# EAGLE design PSPS_AVNC_SRD_fullBoard-2020-09-19 (EAGLE 9.6.2)
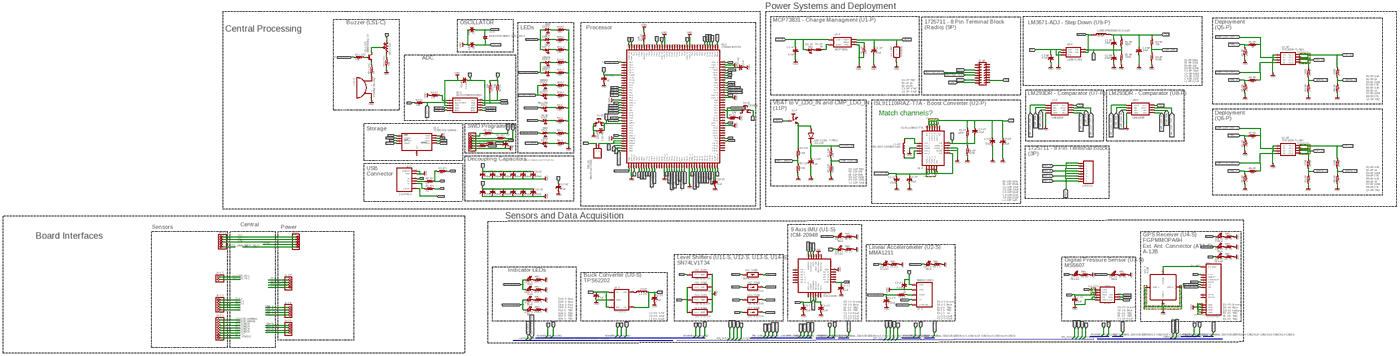
[diagram p0: schematic, sheet 1, overview]
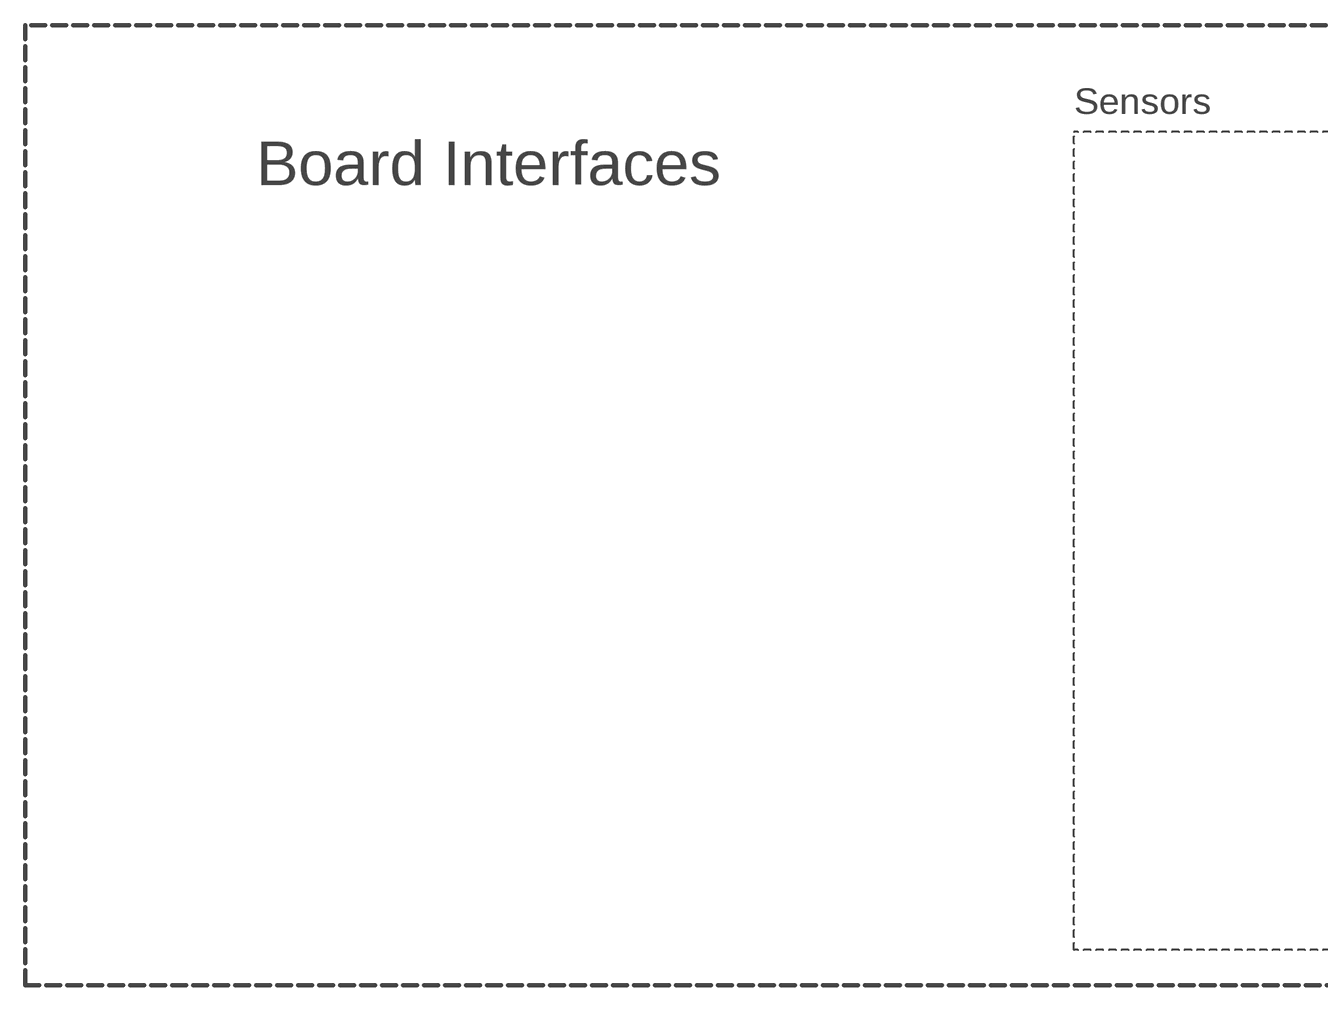
[diagram p1: schematic, sheet 1, part 1 of 4]
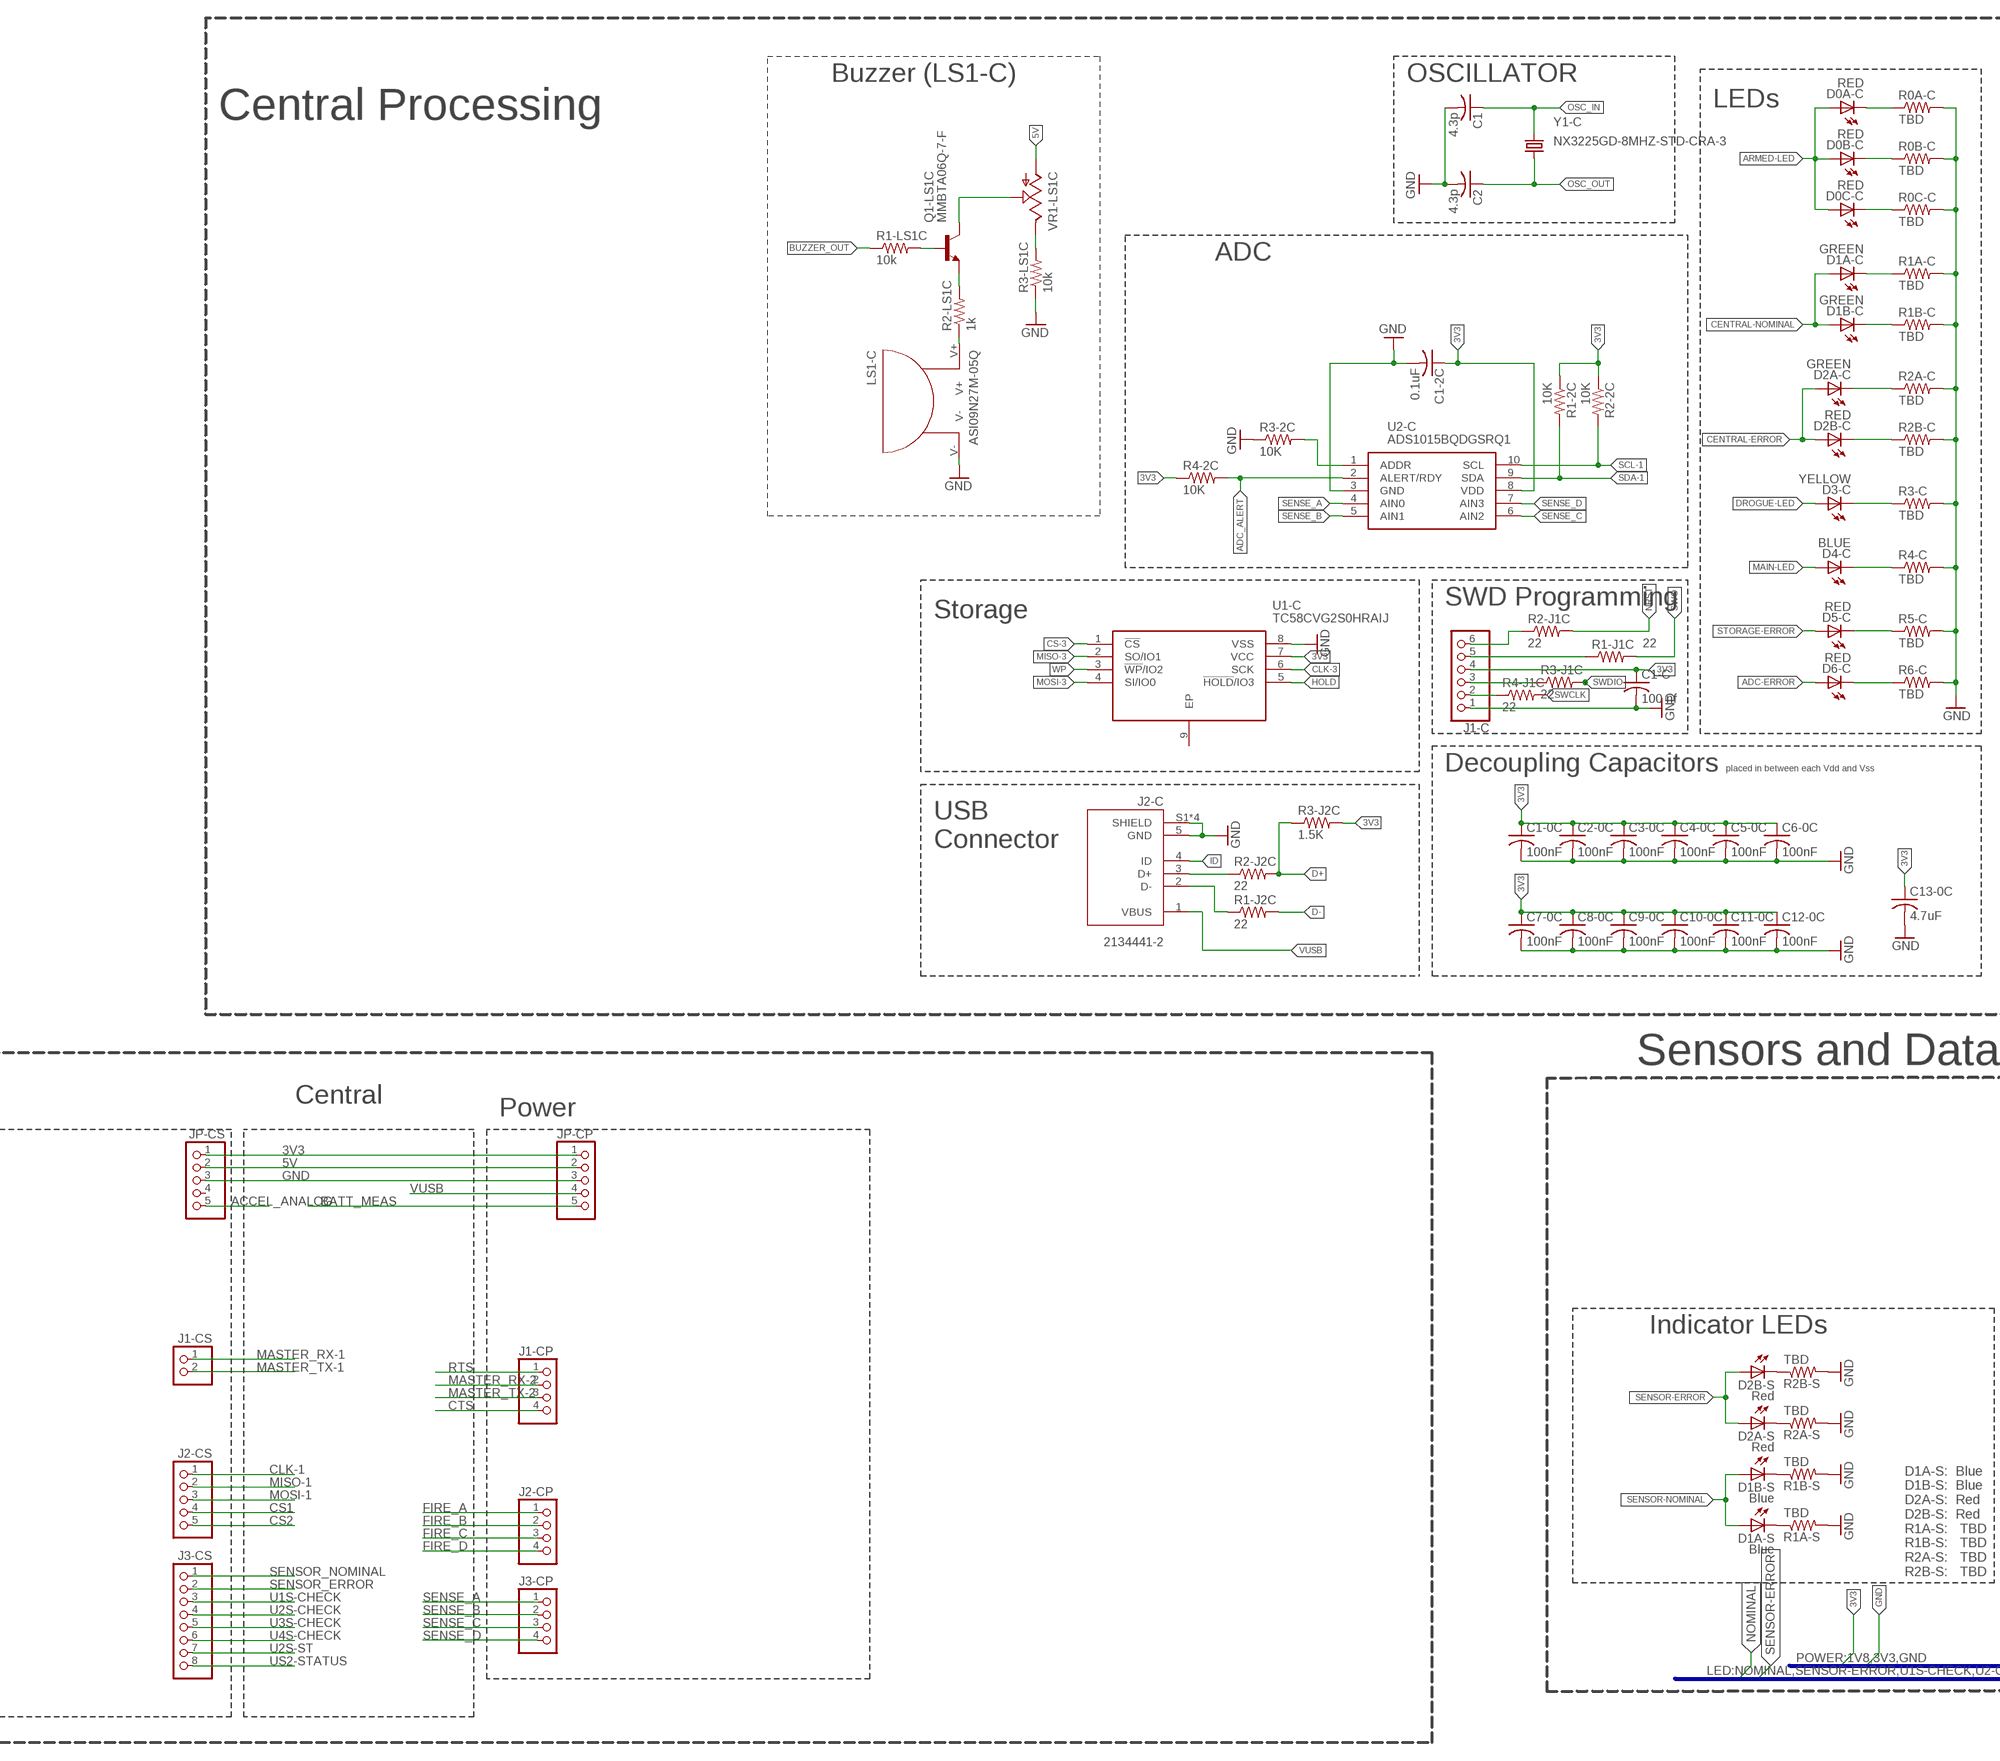
[diagram p2: schematic, sheet 1, part 2 of 4]
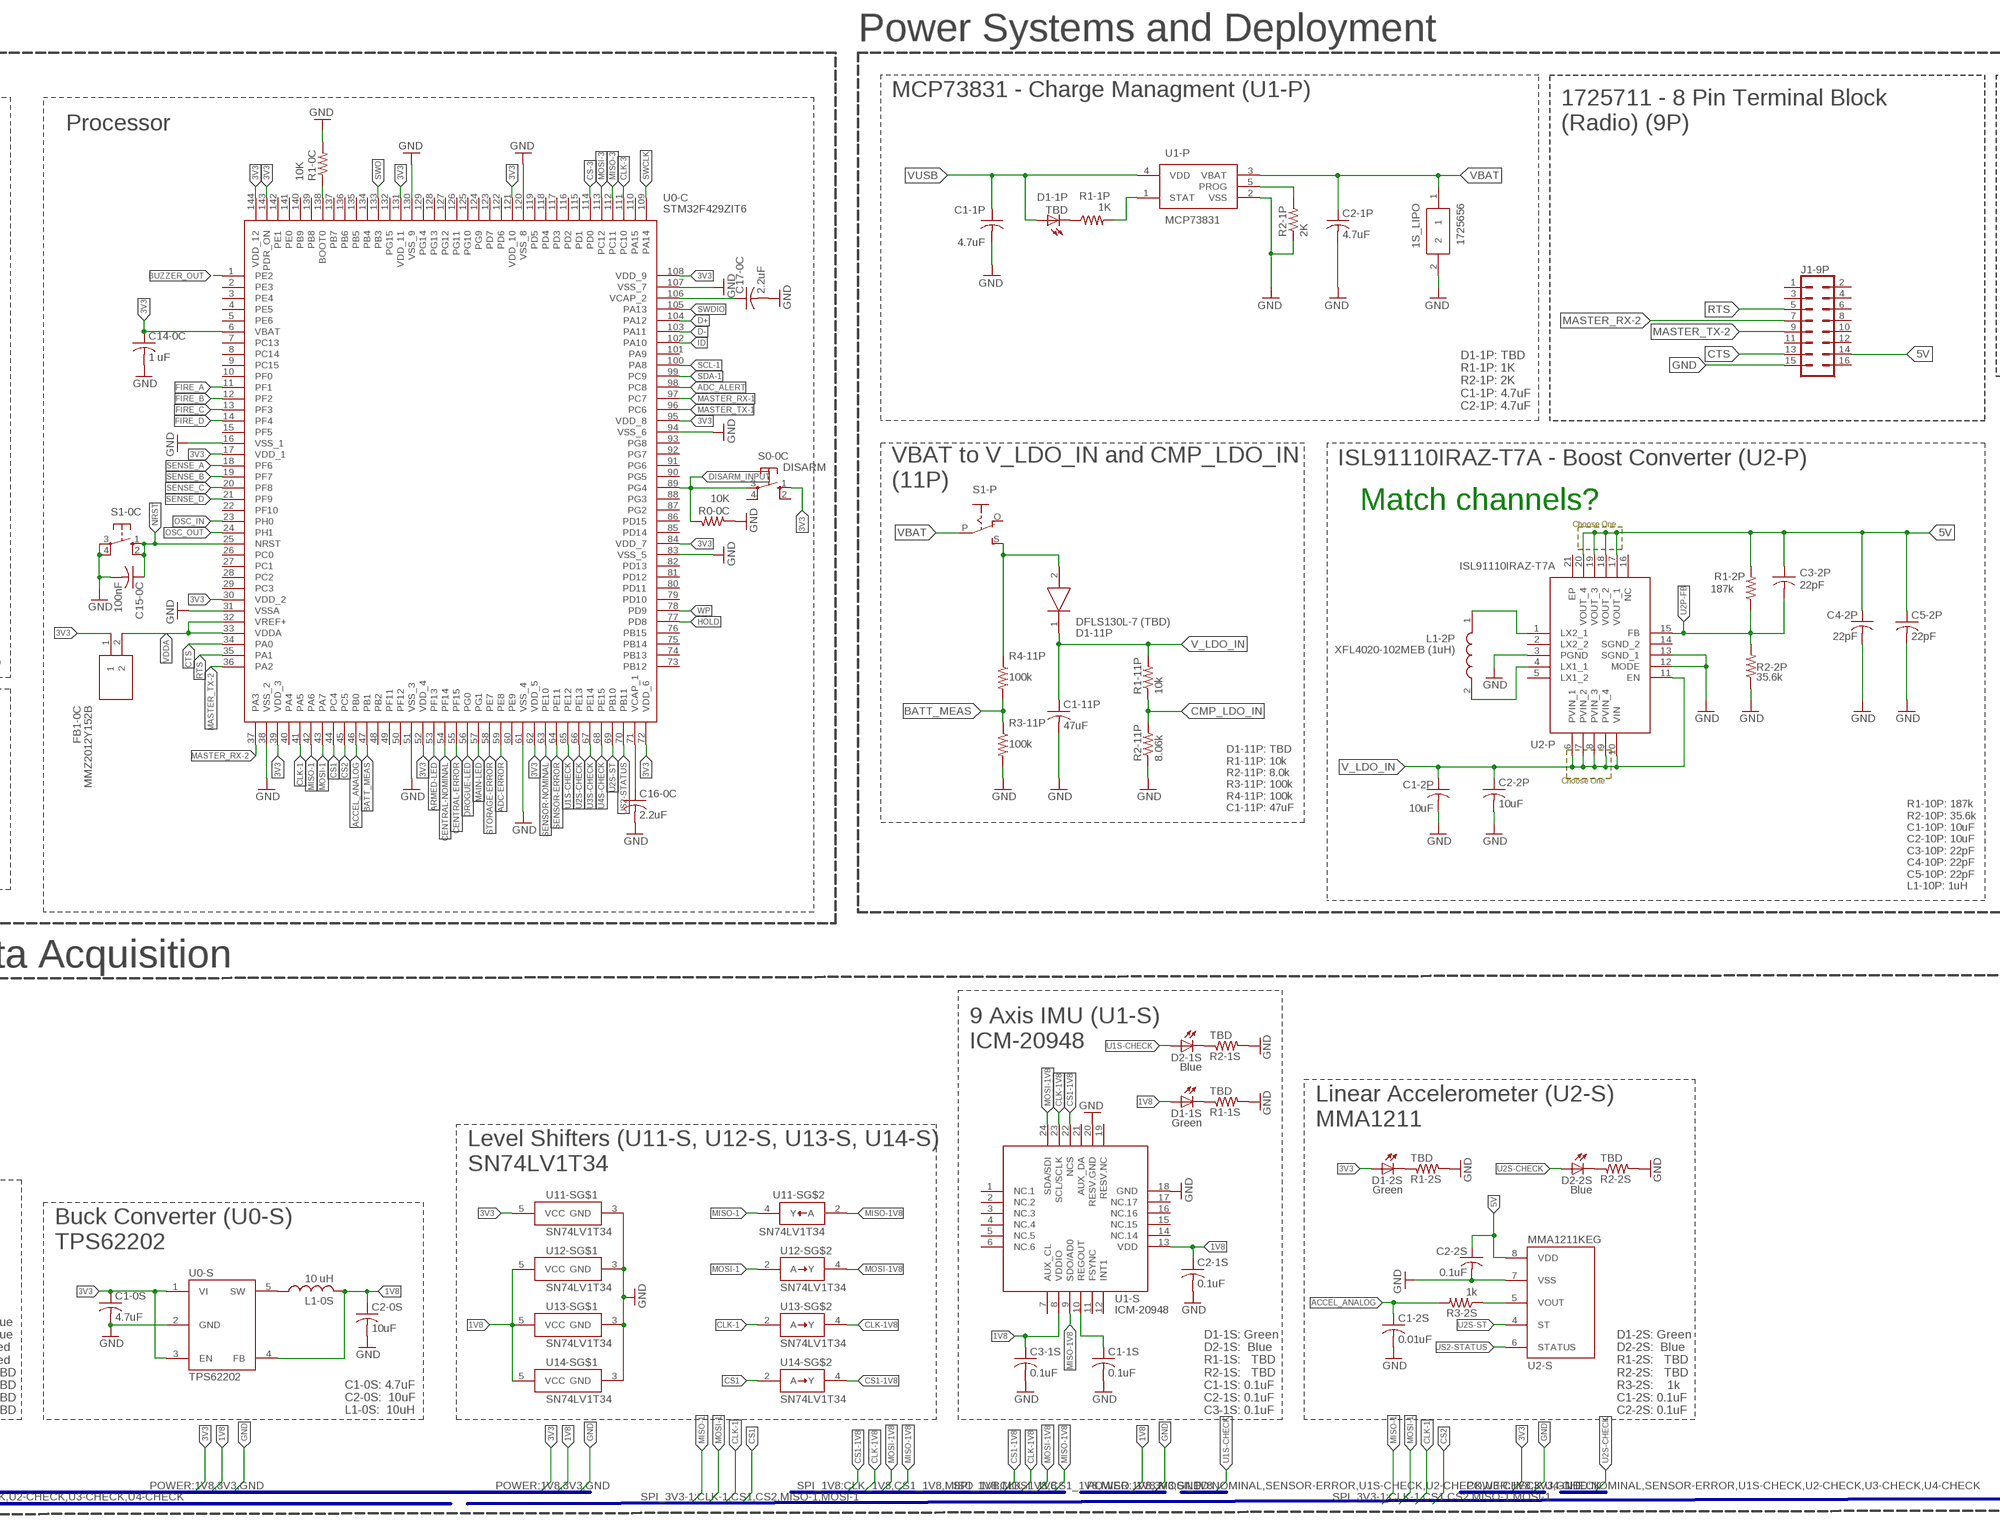
[diagram p3: schematic, sheet 1, part 3 of 4]
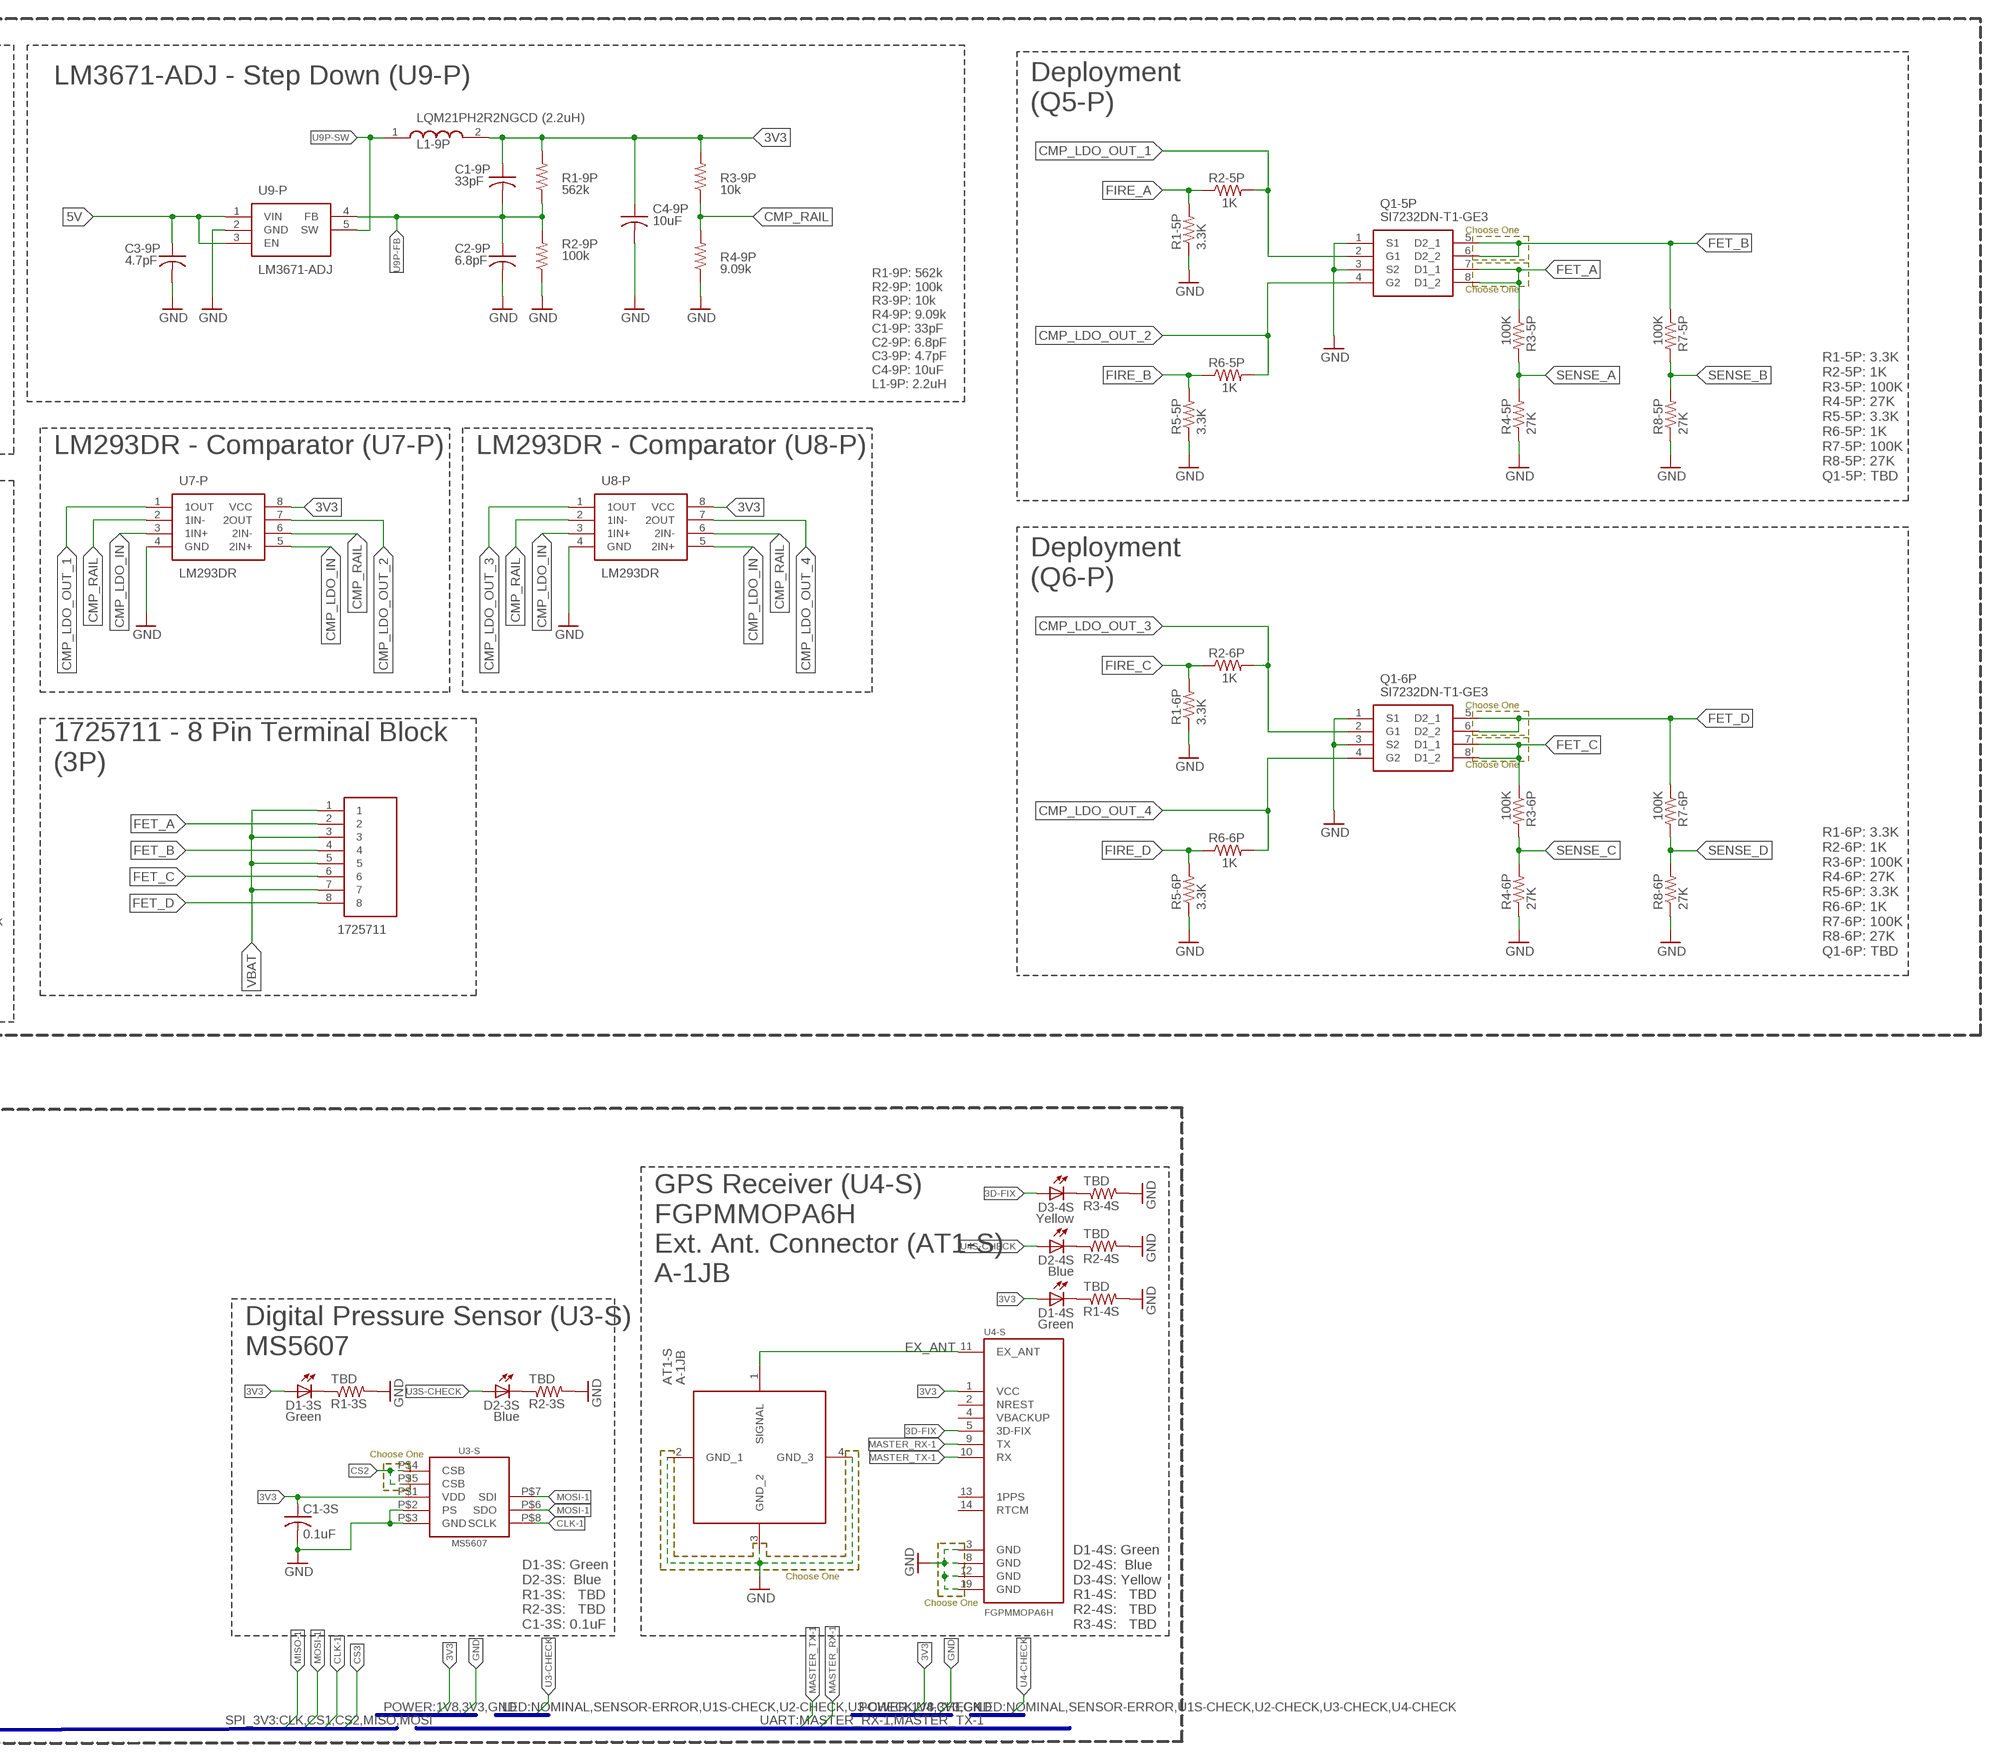
[diagram p4: schematic, sheet 1, part 4 of 4]

## Parts
1S_LIPO  1725656  [1725656]
AT1-S  A-1JB  [A1JB]
C1  4.3p  C-USC0805  [C0805]
C1-0C  100nF  C-USC0805  [C0805]
C1-0S  4.7uF  C-USC0805  [C0805]
C1-1P  4.7uF  C-USC0805  [C0805]
C1-1S  0.1uF  C-USC0805  [C0805]
C1-2C  0.1uF  C-USC0805  [C0805]
C1-2P  10uF  C-USC0805  [C0805]
C1-2S  0.01uF  C-USC0805  [C0805]
C1-3S  0.1uF  C-USC0805  [C0805]
C1-9P  33pF  C-USC0805  [C0805]
C1-11P  47uF  C-USC0805  [C0805]
C1-C  100 nf  C-USC0805  [C0805]
C2  4.3p  C-USC0805  [C0805]
C2-0C  100nF  C-USC0805  [C0805]
C2-0S  10uF  C-USC0805  [C0805]
C2-1P  4.7uF  C-USC0805  [C0805]
C2-1S  0.1uF  C-USC0805  [C0805]
C2-2P  10uF  C-USC0805  [C0805]
C2-2S  0.1uF  C-USC0805  [C0805]
C2-9P  6.8pF  C-USC0805  [C0805]
C3-0C  100nF  C-USC0805  [C0805]
C3-1S  0.1uF  C-USC0805  [C0805]
C3-2P  22pF  C-USC0805  [C0805]
C3-9P  4.7pF  C-USC0805  [C0805]
C4-0C  100nF  C-USC0805  [C0805]
C4-2P  22pF  C-USC0805  [C0805]
C4-9P  10uF  C-USC0805  [C0805]
C5-0C  100nF  C-USC0805  [C0805]
C5-2P  22pF  C-USC0805  [C0805]
C6-0C  100nF  C-USC0805  [C0805]
C7-0C  100nF  C-USC0805  [C0805]
C8-0C  100nF  C-USC0805  [C0805]
C9-0C  100nF  C-USC0805  [C0805]
C10-0C  100nF  C-USC0805  [C0805]
C11-0C  100nF  C-USC0805  [C0805]
C12-0C  100nF  C-USC0805  [C0805]
C13-0C  4.7uF  C-USC0805  [C0805]
C14-0C  1 uF  C-USC0805  [C0805]
C15-0C  100nF  C-USC0805  [C0805]
C16-0C  2.2uF  C-USC0805  [C0805]
C17-0C  2.2uF  C-USC0805  [C0805]
D0A-C  RED  LEDCHIPLED_0805  [CHIPLED_0805]
D0B-C  RED  LEDCHIPLED_0805  [CHIPLED_0805]
D0C-C  RED  LEDCHIPLED_0805  [CHIPLED_0805]
D1-1P  TBD  LEDCHIPLED_0805  [CHIPLED_0805]
D1-1S  Green  LEDCHIPLED_0805  [CHIPLED_0805]
D1-2S  Green  LEDCHIPLED_0805  [CHIPLED_0805]
D1-3S  Green  LEDCHIPLED_0805  [CHIPLED_0805]
D1-4S  Green  LEDCHIPLED_0805  [CHIPLED_0805]
D1-11P  DFLS130L-7 (TBD)  DFLS130L-7  [POWERDI_123]
D1A-C  GREEN  LEDCHIPLED_0805  [CHIPLED_0805]
D1A-S  Blue  LEDCHIPLED_0805  [CHIPLED_0805]
D1B-C  GREEN  LEDCHIPLED_0805  [CHIPLED_0805]
D1B-S  Blue  LEDCHIPLED_0805  [CHIPLED_0805]
D2-1S  Blue  LEDCHIPLED_0805  [CHIPLED_0805]
D2-2S  Blue  LEDCHIPLED_0805  [CHIPLED_0805]
D2-3S  Blue  LEDCHIPLED_0805  [CHIPLED_0805]
D2-4S  Blue  LEDCHIPLED_0805  [CHIPLED_0805]
D2A-C  GREEN  LEDCHIPLED_0805  [CHIPLED_0805]
D2A-S  Red  LEDCHIPLED_0805  [CHIPLED_0805]
D2B-C  RED  LEDCHIPLED_0805  [CHIPLED_0805]
D2B-S  Red  LEDCHIPLED_0805  [CHIPLED_0805]
D3-4S  Yellow  LEDCHIPLED_0805  [CHIPLED_0805]
D3-C  YELLOW  LEDCHIPLED_0805  [CHIPLED_0805]
D4-C  BLUE  LEDCHIPLED_0805  [CHIPLED_0805]
D5-C  RED  LEDCHIPLED_0805  [CHIPLED_0805]
D6-C  RED  LEDCHIPLED_0805  [CHIPLED_0805]
FB1-0C  MMZ2012Y152B  [BEADC2012X105N]
J1-9P  CONN_08X2  [2X8]
J1-C  PINHD-1X6  [1X06]
J1-CP  PINHD-1X4  [1X04]
J1-CS  PINHD-1X2  [1X02]
J2-C  2134441-2  [TE_2134441-2]
J2-CP  PINHD-1X4  [1X04]
J2-CS  PINHD-1X5  [1X05]
J2-P  1725711  [1725711]
J3-CP  PINHD-1X4  [1X04]
J3-CS  PINHD-1X8  [1X08]
JP-CP  PINHD-1X5  [1X05]
JP-CS  PINHD-1X5  [1X05]
L1-0S  10 uH  PF0560.103NLT  [PF0560NL]
L1-2P  XFL4020-102MEB (1uH)  XFL4020-102MEB  [XFL4020]
L1-9P  LQM21PH2R2NGCD (2.2uH)  LQM21PH2R2NGCD  [INDC2012X100N]
LS1-C  ASI09N27M-05Q  [ASI09N27M-05Q]
Q1-5P  SI7232DN-T1-GE3  [POWERPAK-1212-8]
Q1-6P  SI7232DN-T1-GE3  [POWERPAK-1212-8]
Q1-LS1C  MMBTA06Q-7-F  NPN_TRANSISTOR  [SOT23]
R0-0C  10K  R-US_R0805  [R0805]
R0A-C  TBD  R-US_M0805  [M0805]
R0B-C  TBD  R-US_M0805  [M0805]
R0C-C  TBD  R-US_M0805  [M0805]
R1-0C  10K  R-US_R0805  [R0805]
R1-1P  1K  R-US_R0805  [R0805]
R1-1S  TBD  R-US_R0805  [R0805]
R1-2C  10K  R-US_R0805  [R0805]
R1-2P  187k  R-US_R0805  [R0805]
R1-2S  TBD  R-US_R0805  [R0805]
R1-3S  TBD  R-US_R0805  [R0805]
R1-4S  TBD  R-US_R0805  [R0805]
R1-5P  3.3K  R-US_M0805  [M0805]
R1-6P  3.3K  R-US_M0805  [M0805]
R1-9P  562k  R-US_R0805  [R0805]
R1-11P  10k  R-US_R0805  [R0805]
R1-J1C  22  R-US_M0805  [M0805]
R1-J2C  22  R-US_M0805  [M0805]
R1-LS1C  10k  R-US_R0805  [R0805]
R1A-C  TBD  R-US_M0805  [M0805]
R1A-S  TBD  R-US_R0805  [R0805]
R1B-C  TBD  R-US_M0805  [M0805]
R1B-S  TBD  R-US_R0805  [R0805]
R2-1P  2K  R-US_R0805  [R0805]
R2-1S  TBD  R-US_R0805  [R0805]
R2-2C  10K  R-US_R0805  [R0805]
R2-2P  35.6k  R-US_R0805  [R0805]
R2-2S  TBD  R-US_R0805  [R0805]
R2-3S  TBD  R-US_R0805  [R0805]
R2-4S  TBD  R-US_R0805  [R0805]
R2-5P  1K  R-US_M0805  [M0805]
R2-6P  1K  R-US_M0805  [M0805]
R2-9P  100k  R-US_R0805  [R0805]
R2-11P  8.06k  R-US_R0805  [R0805]
R2-J1C  22  R-US_M0805  [M0805]
R2-J2C  22  R-US_M0805  [M0805]
R2-LS1C  1k  R-US_R0805  [R0805]
R2A-C  TBD  R-US_M0805  [M0805]
R2A-S  TBD  R-US_R0805  [R0805]
R2B-C  TBD  R-US_M0805  [M0805]
R2B-S  TBD  R-US_R0805  [R0805]
R3-2C  10K  R-US_R0805  [R0805]
R3-2S  1k  R-US_R0805  [R0805]
R3-4S  TBD  R-US_R0805  [R0805]
R3-5P  100K  R-US_M0805  [M0805]
R3-6P  100K  R-US_M0805  [M0805]
R3-9P  10k  R-US_R0805  [R0805]
R3-11P  100k  R-US_R0805  [R0805]
R3-C  TBD  R-US_M0805  [M0805]
R3-J1C  22  R-US_M0805  [M0805]
R3-J2C  1.5K  R-US_M0805  [M0805]
R3-LS1C  10k  R-US_R0805  [R0805]
R4-2C  10K  R-US_R0805  [R0805]
R4-5P  27K  R-US_M0805  [M0805]
R4-6P  27K  R-US_M0805  [M0805]
R4-9P  9.09k  R-US_R0805  [R0805]
R4-11P  100k  R-US_R0805  [R0805]
R4-C  TBD  R-US_M0805  [M0805]
R4-J1C  22  R-US_M0805  [M0805]
R5-5P  3.3K  R-US_M0805  [M0805]
R5-6P  3.3K  R-US_M0805  [M0805]
R5-C  TBD  R-US_M0805  [M0805]
R6-5P  1K  R-US_M0805  [M0805]
R6-6P  1K  R-US_M0805  [M0805]
R6-C  TBD  R-US_M0805  [M0805]
R7-5P  100K  R-US_M0805  [M0805]
R7-6P  100K  R-US_M0805  [M0805]
R8-5P  27K  R-US_M0805  [M0805]
R8-6P  27K  R-US_M0805  [M0805]
S0-0C  DISARM  10-XX  [B3F-10XX]
S1-0C  10-XX  [B3F-10XX]
S1-P  EG1218S  [EG1218]
U0-C  STM32F429ZIT6  [QFP50P2200X2200X160-144N]
U0-S  TPS62202  [SOT95P280X145-5]
U1-C  TC58CVG2S0HRAIJ  [SON127P800X600X80-9N]
U1-P  MCP73831  MCP73831T-2ACI_OT  [SOT95P270X145-5N]
U1-S  ICM-20948  [QFN40P300X300X105-25T159X175]
U2-C  ADS1015BQDGSRQ1  [SOP50P490X110-10N]
U2-P  ISL91110IRAZ-T7A  [QFN50P400X400X100-21N]
U2-S  MMA1211KEG  [SOIC127P1041X355-16N]
U3-S  MS5607  [MS5607]
U4-S  FGPMMOPA6H  [SOIC127P1800X470-20N]
U7-P  LM293DR  [SOIC127P600X175-8N]
U8-P  LM293DR  [SOIC127P600X175-8N]
U9-P  LM3671-ADJ  LM3671MFX-ADJ_NOPB  [SOT95P280X145-5N]
U11-S  SN74LV1T34  [SOT65P210X110-5]
U12-S  SN74LV1T34  [SOT65P210X110-5]
U13-S  SN74LV1T34  [SOT65P210X110-5]
U14-S  SN74LV1T34  [SOT65P210X110-5]
VR1-LS1C  TRIM_US-LI10  [LI10]
Y1-C  NX3225GD-8MHZ-STD-CRA-3  KX-7  [3.2X2.5_KX-7]

## Nets
1V8: C2-0S.1 C2-1S.1 C3-1S.1 D1-1S.A L1-0S.P$2 U0-S.4(FB) U1-S.8(VDDIO) U1-S.13(VDD) U12-S.5(VCC) U13-S.5(VCC) U14-S.5(VCC)
3D-FIX: D3-4S.A U4-S.5(3D-FIX)
3V3: C1-0C.1 C1-0S.1 C1-2C.1 C1-3S.1 C1-9P.1 C1-C.1 C2-0C.1 C3-0C.1 C4-0C.1 C4-9P.1 C5-0C.1 C6-0C.1 C7-0C.1 C8-0C.1 C9-0C.1 C10-0C.1 C11-0C.1 C12-0C.1 C13-0C.1 C14-0C.1 D1-2S.A D1-3S.A D1-4S.A FB1-0C.1 J1-C.4 JP-CP.1 JP-CS.1 L1-9P.2 R1-2C.1 R1-9P.2 R2-2C.1 R3-9P.2 R3-J2C.2 R4-2C.1 S0-0C.1(S) U0-C.6(VBAT) U0-C.17(VDD_1) U0-C.30(VDD_2) U0-C.39(VDD_3) U0-C.52(VDD_4) U0-C.62(VDD_5) U0-C.72(VDD_6) U0-C.84(VDD_7) U0-C.95(VDD_8) U0-C.108(VDD_9) U0-C.121(VDD_10) U0-C.131(VDD_11) U0-C.143(PDR_ON) U0-C.144(VDD_12) U0-S.1(VI) U0-S.3(EN) U1-C.7(VCC) U2-C.8(VDD) U3-S.P$1(VDD) U4-S.1(VCC) U7-P.8(VCC) U8-P.8(VCC) U11-S.5(VCC)
5V: C2-2S.1 C3-2P.1 C3-9P.1 C4-2P.1 C5-2P.1 J1-9P.14 JP-CP.2 JP-CS.2 R1-2P.2 U2-P.17(VOUT_1) U2-P.18(VOUT_2) U2-P.19(VOUT_3) U2-P.20(VOUT_4) U2-S.8(VDD) U9-P.1(VIN) U9-P.3(EN) VR1-LS1C.A
ACCEL_ANALOG: C1-2S.1 JP-CS.5 R3-2S.2 U0-C.46(PB0)
ADC-ERROR: D6-C.A U0-C.59(PE8)
ADC_ALERT: R4-2C.2 U0-C.98(PC8) U2-C.2(ALERT/RDY)
ADDR: R3-2C.2 U2-C.1(ADDR)
ARMED-LED: D0A-C.A D0B-C.A D0C-C.A U0-C.53(PF13)
BATT_MEAS: JP-CP.5 R3-11P.1 R4-11P.2 U0-C.47(PB1)
BOOT0: R1-0C.1 U0-C.138(BOOT0)
BUZZER_OUT: R1-LS1C.1 U0-C.1(PE2)
CENTRAL-ERROR: D2A-C.A D2B-C.A U0-C.55(PF15)
CENTRAL-NOMINAL: D1A-C.A D1B-C.A U0-C.54(PF14)
CLK-1: J2-CS.1 U0-C.41(PA5) U3-S.P$8(SCLK) U13-S.2(A)
CLK-1V8: U1-S.23(SCL/SCLK) U13-S.4(Y)
CLK-3: U0-C.111(PC10) U1-C.6(SCK)
CMP_LDO_IN: R1-11P.1 R2-11P.2 U7-P.3(1IN+) U7-P.5(2IN+) U8-P.3(1IN+) U8-P.5(2IN+)
CMP_LDO_OUT_1: Q1-5P.2(G1) R2-5P.2 U7-P.1(1OUT)
CMP_LDO_OUT_2: Q1-5P.4(G2) R6-5P.2 U7-P.7(2OUT)
CMP_LDO_OUT_3: Q1-6P.2(G1) R2-6P.2 U8-P.1(1OUT)
CMP_LDO_OUT_4: Q1-6P.4(G2) R6-6P.2 U8-P.7(2OUT)
CMP_RAIL: R3-9P.1 R4-9P.2 U7-P.2(1IN-) U7-P.6(2IN-) U8-P.2(1IN-) U8-P.6(2IN-)
CS1: J2-CS.4 U0-C.44(PC4) U14-S.2(A)
CS1-1V8: U1-S.22(NCS) U14-S.4(Y)
CS2: J2-CS.5 U0-C.45(PC5) U3-S.P$4(CSB) U3-S.P$5(CSB)
CS-3: U0-C.114(PD0) U1-C.1(!CS)
CTS: J1-9P.13 J1-CP.4 U0-C.34(PA0)
D0A-C_R0A-C: D0A-C.C R0A-C.1
D0B-C_R0B-C: D0B-C.C R0B-C.1
D0C-C_R0C-C: D0C-C.C R0C-C.1
D1-1P_R1-1P: D1-1P.C R1-1P.1
D1-1S_R1-1S: D1-1S.C R1-1S.1
D1-2S_R1-2S: D1-2S.C R1-2S.1
D1-3S_R1-3S: D1-3S.C R1-3S.1
D1-4S_R1-4S: D1-4S.C R1-4S.1
D1A-C_R1A-C: D1A-C.C R1A-C.1
D1A-S_R1A-S: D1A-S.C R1A-S.1
D1B-C_R1B-C: D1B-C.C R1B-C.1
D1B-S_R1B-S: D1B-S.C R1B-S.1
D2-1S_R2-1S: D2-1S.C R2-1S.1
D2-2S_R2-2S: D2-2S.C R2-2S.1
D2-3S_R2-3S: D2-3S.C R2-3S.1
D2-4S_R2-4S: D2-4S.C R2-4S.1
D2A-C_R2A-C: D2A-C.C R2A-C.1
D2A-S_R2A-S: D2A-S.C R2A-S.1
D2B-C_R2B-C: D2B-C.C R2B-C.1
D2B-S_R2B-S: D2B-S.C R2B-S.1
D3-4S_R3-4S: D3-4S.C R3-4S.1
D3-C_R3-C: D3-C.C R3-C.1
D4-C_R4-C: D4-C.C R4-C.1
D5-C_R5-C: D5-C.C R5-C.1
D6-C_R6-C: D6-C.C R6-C.1
D+: R2-J2C.2 R3-J2C.1 U0-C.104(PA12)
D+_R2-J1C: J2-C.3(D+) R2-J2C.1
D-: R1-J2C.2 U0-C.103(PA11)
D-_R1-J1C: J2-C.2(D-) R1-J2C.1
DISARM_INPUT: R0-0C.2 S0-0C.3(P) U0-C.89(PG4)
DROGUE-LED: D3-C.A U0-C.56(PG0)
EX_ANT: AT1-S.1(SIGNAL) U4-S.11(EX_ANT)
FET_A: J2-P.2 Q1-5P.7(D1_1) Q1-5P.8(D1_2) R3-5P.1
FET_B: J2-P.4 Q1-5P.5(D2_1) Q1-5P.6(D2_2) R7-5P.1
FET_C: J2-P.6 Q1-6P.7(D1_1) Q1-6P.8(D1_2) R3-6P.1
FET_D: J2-P.8 Q1-6P.5(D2_1) Q1-6P.6(D2_2) R7-6P.1
FIRE_A: J2-CP.1 R1-5P.2 R2-5P.1 U0-C.11(PF1)
FIRE_B: J2-CP.2 R5-5P.2 R6-5P.1 U0-C.12(PF2)
FIRE_C: J2-CP.3 R1-6P.2 R2-6P.1 U0-C.13(PF3)
FIRE_D: J2-CP.4 R5-6P.2 R6-6P.1 U0-C.14(PF4)
GND: 1S_LIPO.2 AT1-S.2(GND_1) AT1-S.3(GND_2) AT1-S.4(GND_3) C1-0C.2 C1-0S.2 C1-1P.2 C1-1S.2 C1-2C.2 C1-2P.2 C1-2S.2 C1-3S.2 C1-11P.2 C1-C.2 C1.2 C2-0C.2 C2-0S.2 C2-1P.2 C2-1S.2 C2-2P.2 C2-2S.2 C2-9P.2 C2.2 C3-0C.2 C3-1S.2 C3-9P.2 C4-0C.2 C4-2P.2 C4-9P.2 C5-0C.2 C5-2P.2 C6-0C.2 C7-0C.2 C8-0C.2 C9-0C.2 C10-0C.2 C11-0C.2 C12-0C.2 C13-0C.2 C14-0C.2 C15-0C.2 C16-0C.2 C17-0C.2 J1-9P.15 J1-C.1 J2-C.5(GND) J2-C.S1(SHIELD) J2-C.S2(SHIELD) J2-C.S3(SHIELD) J2-C.S4(SHIELD) JP-CP.3 JP-CS.3 LS1-C.V- Q1-5P.1(S1) Q1-5P.3(S2) Q1-6P.1(S1) Q1-6P.3(S2) R0-0C.1 R0A-C.2 R0B-C.2 R0C-C.2 R1-0C.2 R1-1S.2 R1-2S.2 R1-3S.2 R1-4S.2 R1-5P.1 R1-6P.1 R1A-C.2 R1A-S.2 R1B-C.2 R1B-S.2 R2-1P.1 R2-1S.2 R2-2P.1 R2-2S.2 R2-3S.2 R2-4S.2 R2-9P.1 R2-11P.1 R2A-C.2 R2A-S.2 R2B-C.2 R2B-S.2 R3-2C.1 R3-4S.2 R3-11P.2 R3-C.2 R3-LS1C.1 R4-5P.1 R4-6P.1 R4-9P.1 R4-C.2 R5-5P.1 R5-6P.1 R5-C.2 R6-C.2 R8-5P.1 R8-6P.1 S1-0C.3(P) S1-0C.4(P1) U0-C.16(VSS_1) U0-C.31(VSSA) U0-C.38(VSS_2) U0-C.51(VSS_3) U0-C.61(VSS_4) U0-C.83(VSS_5) U0-C.94(VSS_6) U0-C.107(VSS_7) U0-C.120(VSS_8) U0-C.130(VSS_9) U0-S.2(GND) U1-C.8(VSS) U1-P.2(VSS) U1-S.18(GND) U1-S.20(RESV.GND) U2-C.3(GND) U2-P.3(PGND) U2-P.12(MODE) U2-P.13(SGND_1) U2-S.7(VSS) U3-S.P$2(PS) U3-S.P$3(GND) U4-S.3(GND) U4-S.8(GND) U4-S.12(GND) U4-S.19(GND) U7-P.4(GND) U8-P.4(GND) U9-P.2(GND) U11-S.3(GND) U12-S.3(GND) U13-S.3(GND) U14-S.3(GND)
HOLD: U0-C.77(PD8) U1-C.5(!HOLD!/IO3)
ID: J2-C.4(ID) U0-C.102(PA10)
J1-C_R1-J1C: J1-C.5 R1-J1C.1
J1-C_R2-J1C: J1-C.6 R2-J1C.1
MAIN-LED: D4-C.A U0-C.57(PG1)
MASTER_RX-1: J1-CS.1 U0-C.97(PC7) U4-S.9(TX)
MASTER_RX-2: J1-9P.7 J1-CP.2 U0-C.37(PA3)
MASTER_TX-1: J1-CS.2 U0-C.96(PC6) U4-S.10(RX)
MASTER_TX-2: J1-9P.9 J1-CP.3 U0-C.36(PA2)
MISO-1: J2-CS.2 U0-C.42(PA6) U11-S.4(Y)
MISO-1V8: U1-S.9(SDO/AD0) U11-S.2(A)
MISO-3: U0-C.112(PC11) U1-C.2(SO/IO1)
MOSI-1: J2-CS.3 U0-C.43(PA7) U3-S.P$6(SDO) U3-S.P$7(SDI) U12-S.2(A)
MOSI-1V8: U1-S.24(SDA/SDI) U12-S.4(Y)
MOSI-3: U0-C.113(PC12) U1-C.4(SI/IO0)
NRST: C15-0C.1 R2-J1C.2 S1-0C.1(S) S1-0C.2(S1) U0-C.25(NRST)
OSC_IN: C1.1 U0-C.23(PH0) Y1-C.3
OSC_OUT: C2.1 U0-C.24(PH1) Y1-C.1
Q1-LS1C_R2-LS1C: Q1-LS1C.3(E) R2-LS1C.2
R1-LS1C_Q1-LS1C: Q1-LS1C.1(B) R1-LS1C.2
R2-LS1C_LS1-C: LS1-C.V+ R2-LS1C.1
REGOUT: C1-1S.1 U1-S.10(REGOUT)
RTS: J1-9P.5 J1-CP.1 U0-C.35(PA1)
SCL-1: R2-2C.2 U0-C.100(PA8) U2-C.10(SCL)
SDA-1: R1-2C.2 U0-C.99(PC9) U2-C.9(SDA)
SENSE_A: J3-CP.1 R3-5P.2 R4-5P.2 U0-C.18(PF6) U2-C.4(AIN0)
SENSE_B: J3-CP.2 R7-5P.2 R8-5P.2 U0-C.19(PF7) U2-C.5(AIN1)
SENSE_C: J3-CP.3 R3-6P.2 R4-6P.2 U0-C.20(PF8) U2-C.6(AIN2)
SENSE_D: J3-CP.4 R7-6P.2 R8-6P.2 U0-C.21(PF9) U2-C.7(AIN3)
SENSOR-ERROR: D2A-S.A D2B-S.A U0-C.64(PE11)
SENSOR-NOMINAL: D1A-S.A D1B-S.A U0-C.63(PE10)
SENSOR_ERROR: J3-CS.2
SENSOR_NOMINAL: J3-CS.1
STORAGE-ERROR: D5-C.A U0-C.58(PE7)
SWCLK: J1-C.2 R4-J1C.1 R4-J1C.2 U0-C.109(PA14)
SWDIO: J1-C.3 R3-J1C.1 R3-J1C.2 U0-C.105(PA13)
SWO: R1-J1C.2 U0-C.133(PB3)
U0S-SW: L1-0S.P$1 U0-S.5(SW)
U1P-PROG: R2-1P.2 U1-P.5(PROG)
U1P-STAT: R1-1P.2 U1-P.1(STAT)
U1S-CHECK: D2-1S.A J3-CS.3 U0-C.65(PE12)
U2P-FB: C3-2P.2 R1-2P.1 R2-2P.2 U2-P.15(FB)
U2S-CHECK: D2-2S.A J3-CS.4 U0-C.66(PE13)
U2S-ST: J3-CS.7 U0-C.69(PB10) U2-S.4(ST)
U3S-CHECK: D2-3S.A J3-CS.5 U0-C.67(PE14)
U4S-CHECK: D2-4S.A J3-CS.6 U0-C.68(PE15)
U9P-FB: C1-9P.2 C2-9P.1 R1-9P.1 R2-9P.2 U9-P.4(FB)
U9P-LX1_1: L1-2P.2 U2-P.4(LX1_1)
U9P-LX2_1: L1-2P.1 U2-P.1(LX2_1)
U9P-SW: L1-9P.1 U9-P.5(SW)
US2-STATUS: J3-CS.8 U0-C.70(PB11) U2-S.6(STATUS)
V_LDO_IN: C1-2P.1 C1-11P.1 C2-2P.1 D1-11P.1(K) R1-11P.2 U2-P.6(PVIN_1) U2-P.7(PVIN_2) U2-P.8(PVIN_3) U2-P.9(PVIN_4) U2-P.10(VIN) U2-P.11(EN)
VBAT: 1S_LIPO.1 C2-1P.1 J2-P.1 J2-P.3 J2-P.5 J2-P.7 S1-P.P U1-P.3(VBAT)
VBAT_AFTER_SWITCH: D1-11P.2(A) R4-11P.1 S1-P.S
VCAP_1: C16-0C.1 U0-C.71(VCAP_1)
VCAP_2: C17-0C.1 U0-C.106(VCAP_2)
VDDA: FB1-0C.2 U0-C.32(VREF+) U0-C.33(VDDA)
VOUT: R3-2S.1 U2-S.5(VOUT)
VR1-LS1C: Q1-LS1C.2(C) VR1-LS1C.S
VR1-LS1C_R3-LS1C: R3-LS1C.2 VR1-LS1C.E
VUSB: C1-1P.1 D1-1P.A J2-C.1(VBUS) JP-CP.4 U1-P.4(VDD)
WP: U0-C.78(PD9) U1-C.3(!WP!/IO2)
Unconnected: J1-9P.1 J1-9P.2 J1-9P.3 J1-9P.4 J1-9P.6 J1-9P.8 J1-9P.10 J1-9P.11 J1-9P.12 J1-9P.16 JP-CS.4 S0-0C.2(S1) S0-0C.4(P1) S1-P.O U0-C.2(PE3) U0-C.3(PE4) U0-C.4(PE5) U0-C.5(PE6) U0-C.7(PC13) U0-C.8(PC14) U0-C.9(PC15) U0-C.10(PF0) U0-C.15(PF5) U0-C.22(PF10) U0-C.26(PC0) U0-C.27(PC1) U0-C.28(PC2) U0-C.29(PC3) U0-C.40(PA4) U0-C.48(PB2) U0-C.49(PF11) U0-C.50(PF12) U0-C.60(PE9) U0-C.73(PB12) U0-C.74(PB13) U0-C.75(PB14) U0-C.76(PB15) U0-C.79(PD10) U0-C.80(PD11) U0-C.81(PD12) U0-C.82(PD13) U0-C.85(PD14) U0-C.86(PD15) U0-C.87(PG2) U0-C.88(PG3) U0-C.90(PG5) U0-C.91(PG6) U0-C.92(PG7) U0-C.93(PG8) U0-C.101(PA9) U0-C.110(PA15) U0-C.115(PD1) U0-C.116(PD2) U0-C.117(PD3) U0-C.118(PD4) U0-C.119(PD5) U0-C.122(PD6) U0-C.123(PD7) U0-C.124(PG9) U0-C.125(PG10) U0-C.126(PG11) U0-C.127(PG12) U0-C.128(PG13) U0-C.129(PG14) U0-C.132(PG15) U0-C.134(PB4) U0-C.135(PB5) U0-C.136(PB6) U0-C.137(PB7) U0-C.139(PB8) U0-C.140(PB9) U0-C.141(PE0) U0-C.142(PE1) U1-C.9(EP) U1-S.1(NC.1) U1-S.2(NC.2) U1-S.3(NC.3) U1-S.4(NC.4) U1-S.5(NC.5) U1-S.6(NC.6) U1-S.7(AUX_CL) U1-S.11(FSYNC) U1-S.12(INT1) U1-S.14(NC.14) U1-S.15(NC.15) U1-S.16(NC.16) U1-S.17(NC.17) U1-S.19(RESV.NC) U1-S.21(AUX_DA) U2-P.2(LX2_2) U2-P.5(LX1_2) U2-P.14(SGND_2) U2-P.16(NC) U2-P.21(EP) U4-S.2(NREST) U4-S.4(VBACKUP) U4-S.13(1PPS) U4-S.14(RTCM)

## Buses
SPI_3V3:CLK,CS1,CS2,MISO,MOSI
SPI_1V8:CLK_1V8,CS1_1V8,MISO_1V8,MOSI_1V8
POWER:1V8,3V3,GND
LED:NOMINAL,SENSOR-ERROR,U1S-CHECK,U2-CHECK,U3-CHECK,U4-CHECK
UART:MASTER_RX-1,MASTER_TX-1
SPI_3V3-1:CLK-1,CS1,CS2,MISO-1,MOSI-1

## Notes on the sheet
- Power Systems and Deployment
- MCP73831 - Charge Managment (U1-P)
- Buzzer (LS1-C) | OSCILLATOR | LM3671-ADJ - Step Down (U9-P)
- LEDs | Processor
- 1725711 - 8 Pin Terminal Block 
  (Radio) (9P)
- Deployment
  (Q5-P)
- Central Processing
- Choose One
- ADC
- Choose One
- R1-9P: 562k
  R2-9P: 100k
  R3-9P: 10k
  R4-9P: 9.09k
  C1-9P: 33pF
  C2-9P: 6.8pF
  C3-9P: 4.7pF
  C4-9P: 10uF
  L1-9P: 2.2uH
- D1-1P: TBD
  R1-1P: 1K
  R2-1P: 2K
  C1-1P: 4.7uF
  C2-1P: 4.7uF
- LM293DR - Comparator (U7-P) | LM293DR - Comparator (U8-P)
- R1-5P: 3.3K
  R2-5P: 1K
  R3-5P: 100K
  R4-5P: 27K
  R5-5P: 3.3K
  R6-5P: 1K
  R7-5P: 100K
  R8-5P: 27K
  Q1-5P: TBD
- ISL91110IRAZ-T7A - Boost Converter (U2-P)
- VBAT to V_LDO_IN and CMP_LDO_IN
  (11P)
- Match channels?
- Choose One
- Deployment
  (Q6-P)
- SWD Programming
- Storage
- Choose One
- Choose One
- 1725711 - 8 Pin Terminal Block
  (3P)
- Decoupling Capacitors | placed in between each Vdd and Vss
- USB 
  Connector
- Choose One
- D1-11P: TBD
  R1-11P: 10k
  R2-11P: 8.0k
  R3-11P: 100k
  R4-11P: 100k
  C1-11P: 47uF
- R1-6P: 3.3K
  R2-6P: 1K
  R3-6P: 100K
  R4-6P: 27K
  R5-6P: 3.3K
  R6-6P: 1K
  R7-6P: 100K
  R8-6P: 27K
  Q1-6P: TBD
- R1-10P: 187k
  R2-10P: 35.6k
  C1-10P: 10uF
  C2-10P: 10uF
  C3-10P: 22pF
  C4-10P: 22pF
  C5-10P: 22pF
  L1-10P: 1uH
- Sensors and Data Acquisition
- Central
- Sensors | Power
- 9 Axis IMU (U1-S)
  ICM-20948
- Board Interfaces
- GPS Receiver (U4-S)
  FGPMMOPA6H
  Ext. Ant. Connector (AT1-S)
  A-1JB
- Linear Accelerometer (U2-S)
  MMA1211
- Level Shifters (U11-S, U12-S, U13-S, U14-S)
  SN74LV1T34
- Digital Pressure Sensor (U3-S)
  MS5607
- Indicator LEDs
- Buck Converter (U0-S)
  TPS62202
- Choose One
- Choose One
- Choose One
- D1A-S:  Blue
  D1B-S:  Blue
  D2A-S:  Red
  D2B-S:  Red
  R1A-S:   TBD
  R1B-S:   TBD
  R2A-S:   TBD
  R2B-S:   TBD
- C1-0S: 4.7uF
  C2-0S:  10uF
  L1-0S:  10uH
- D1-1S: Green
  D2-1S:  Blue
  R1-1S:   TBD
  R2-1S:   TBD
  C1-1S: 0.1uF
  C2-1S: 0.1uF
  C3-1S: 0.1uF
- D1-2S: Green
  D2-2S:  Blue
  R1-2S:   TBD
  R2-2S:   TBD
  R3-2S:    1k
  C1-2S: 0.1uF
  C2-2S: 0.1uF
- D1-3S: Green
  D2-3S:  Blue
  R1-3S:   TBD
  R2-3S:   TBD
  C1-3S: 0.1uF
- D1-4S: Green
  D2-4S:  Blue
  D3-4S: Yellow
  R1-4S:   TBD
  R2-4S:   TBD
  R3-4S:   TBD

## Library data of the parts
1S_LIPO = SamacSys_Parts:1725656: 2 way PCB vertical mount terminal,2.54mm 2 way PCB vertical mount terminal,2.54mm Source: Datasheet <https://componentsearchengine.com/Datasheets/1/1725656.pdf>; DESCRIPTION: 2 way PCB vertical mount terminal,2.54mm 2 way PCB vertical mount terminal,2.54mm; HEIGHT: 8mm; MANUFACTURER_NAME: Phoenix Contact; MANUFACTURER_PART_NUMBER: 1725656; MOUSER_PART_NUMBER: 651-1725656; MOUSER_PRICE-STOCK: https://www.mouser.com/Search/Refine.aspx?Keyword=651-1725656
AT1-S = SamacSys_Parts:A-1JB: AMC Straight PCB Jack, Surface Mount Source: Datasheet <https://componentsearchengine.com/Datasheets/1/A-1JB.pdf>; DESCRIPTION: AMC Straight PCB Jack, Surface Mount; HEIGHT: 1.05mm; MANUFACTURER_NAME: Amphenol; MANUFACTURER_PART_NUMBER: A-1JB; MOUSER_PART_NUMBER: 523-A-1JB; MOUSER_PRICE-STOCK: https://www.mouser.com/Search/Refine.aspx?Keyword=523-A-1JB
C1 C1-0C C1-2C C1-C C2 C2-0C C3-0C C4-0C C5-0C C6-0C C7-0C C8-0C C9-0C C10-0C C11-0C C12-0C C13-0C C14-0C C15-0C C16-0C C17-0C = rcl:C-US: CAPACITOR, American symbol; SPICEPREFIX: C
C1-0S C1-1P C1-1S C1-2P C1-2S C1-3S C1-9P C1-11P C2-0S C2-1P C2-1S C2-2S C2-9P C3-1S C3-2P C3-9P C4-9P = resistor:C-US: CAPACITOR, American symbol
C2-2P C5-2P = BeagleBone_Black_Wireless:C-US: CAPACITOR, American symbol
C4-2P = resistor:C-US: CAPACITOR, American symbol; SPICEPREFIX: C
D0A-C D0B-C D0C-C D1-1P D1-1S D1-2S D1-3S D1-4S D1A-C D1A-S D1B-C D1B-S D2-1S D2-2S D2-3S D2-4S D2A-C D2A-S D2B-C D2B-S D3-4S D3-C D4-C D5-C D6-C = adafruit:LED: LED OSRAM: - CHIPLED LG R971, LG N971, LY N971, LG Q971, LY Q971, LO R971, LY R971 LH N974, LH R974 LS Q976, LO Q976, LY Q976 LO Q996 - Hyper CHIPLED LW Q18S LB Q993, LB Q99A, LB R99A - SideLED LS A670, LO A670, LY A670, LG A670, LP A670 LB A673, LV A673, LT A673, LW A673 LH A674 LY A675 LS A676, LA A676, LO A676, LY A676, LW A676 LS A679, LY A679, LG A679 - Hyper Micro SIDELED® LS Y876, LA Y876, LO Y876, LY Y876 LT Y87S - SmartLED LW L88C, LW L88S LB L89C, LB L89S, LG L890 LS L89K, LO L89K, LY L89K LS L896, LA L896, LO L896, LY L896 - TOPLED LS T670, LO T670, LY T670, LG T670, LP T670 LSG T670, LSP T670, LSY T670, LOP T670, LYG T670 LG T671, LOG T671, LSG T671 LB T673, LV T673, LT T673, LW T673 LH T674 LS T676, LA T676, LO T676, LY T676, LB T676, LH T676, LSB T676, LW T676 LB T67C, LV T67C, LT T67C, LS T67K, LO T67K, LY T67K, LW E67C LS E67B, LA E67B, LO E67B, LY E67B, LB E67C, LV E67C, LT E67C LW T67C LS T679, LY T679, LG T679 LS T770, LO T770, LY T770, LG T770, LP T770 LB T773, LV T773, LT T773, LW T773 LH T774 LS E675, LA E675, LY E675, LS T675 LS T776, LA T776, LO T776, LY T776, LB T776 LHGB T686 LT T68C, LB T68C - Hyper Mini TOPLED® LB M676 - Mini TOPLED Santana® LG M470 LS M47K, LO M47K, LY M47K Source: http://www.osram.convergy.de/
D1-11P = SamacSys_Parts:DFLS130L-7: 1.0A SURFACE MOUNT SCHOTTKY BARRIER RECTIFIER Source: Datasheet <https://componentsearchengine.com/Datasheets/1/DFLS130L-7.pdf>; DESCRIPTION: 1.0A SURFACE MOUNT SCHOTTKY BARRIER RECTIFIER; HEIGHT: mm; MANUFACTURER_NAME: Diodes Inc.; MANUFACTURER_PART_NUMBER: DFLS130L-7; MOUSER_PART_NUMBER: 621-DFLS130L; MOUSER_PRICE-STOCK: https://www.mouser.com/Search/Refine.aspx?Keyword=621-DFLS130L
FB1-0C = SamacSys_Parts:MMZ2012Y152B: Ferrite bead SMD 1500Ohm 500mA TDK Ferrite Bead (Chip Bead), 2 x 1.25 x 0.85mm (0805) Source: Datasheet <https://componentsearchengine.com/Datasheets/1/MMZ2012Y152B.pdf>; DESCRIPTION: Ferrite bead SMD 1500Ohm 500mA TDK Ferrite Bead (Chip Bead), 2 x 1.25 x 0.85mm (0805); HEIGHT: 1.05mm; MANUFACTURER_NAME: TDK; MANUFACTURER_PART_NUMBER: MMZ2012Y152B; MOUSER_PART_NUMBER: 810-MMZ2012Y152B; MOUSER_PRICE-STOCK: https://www.mouser.com/Search/Refine.aspx?Keyword=810-MMZ2012Y152B
J1-9P = SparkFun-Connectors:CONN_08X2: Multi connection point. Often used as Generic Header-pin footprint for 0.1 inch spaced/style header connections You can populate with any combo of single row headers, but if you'd like an exact match, check this: Header - 2x8 (Male, 0.1") <https://www.sparkfun.com/products/13156> (PRT-13156) On any of the 0.1 inch spaced packages, you can populate with these: Break Away Headers - Straight <https://www.sparkfun.com/products/116> (PRT-00116) Break Away Male Headers - Right Angle <https://www.sparkfun.com/products/553> (PRT-00553) Female Headers <https://www.sparkfun.com/products/115> (PRT-00115) Break Away Headers - Machine Pin <https://www.sparkfun.com/products/117> (PRT-00117) Break Away Female Headers - Swiss Machine Pin <https://www.sparkfun.com/products/743> (PRT-00743)
J1-C = pinhead:PINHD-1X6: PIN HEADER
J1-CP J2-CP J3-CP = pinhead:PINHD-1X4: PIN HEADER
J1-CS = pinhead:PINHD-1X2: PIN HEADER
J2-C = 2134441-2:2134441-2: Conn Micro USB RCP 5 POS 0.65mm Solder RA SMD 5 Terminal 1 Port T/R; COMMENT: 2134441-2; DESCRIPTION: Conn Micro USB RCP 5 POS 0.65mm Solder RA SMD 5 Terminal 1 Port T/R; DIGI-KEY_PART_NUMBER: A118104CT-ND; DIGI-KEY_PURCHASE_URL: https://www.digikey.com/product-detail/en/te-connectivity-amp-connectors/2134441-2/A118104CT-ND/4729911?utm_source=snapeda&utm_medium=aggregator&utm_campaign=symbol; MF: TE Connectivity; MP: 2134441-2; PACKAGE: None; TE_PURCHASE_URL: https://www.te.com/usa-en/product-2134441-2.html?te_bu=Cor&te_type=disp&te_campaign=seda_glo_cor-seda-global-disp-prtnr-fy19-seda-model-bom-cta_sma-317_1&elqCampaignId=32493
J2-CS JP-CP JP-CS = pinhead:PINHD-1X5: PIN HEADER
J2-P = SamacSys_Parts:1725711: 8 way PCB vertical mount terminal,2.54mm 8 way PCB vertical mount terminal,2.54mm Source: Datasheet <https://componentsearchengine.com/Datasheets/1/1725711.pdf>; DESCRIPTION: 8 way PCB vertical mount terminal,2.54mm 8 way PCB vertical mount terminal,2.54mm; HEIGHT: mm; MANUFACTURER_NAME: Phoenix Contact; MANUFACTURER_PART_NUMBER: 1725711; MOUSER_PART_NUMBER: 651-1725711; MOUSER_PRICE-STOCK: https://www.mouser.com/Search/Refine.aspx?Keyword=651-1725711
J3-CS = pinhead:PINHD-1X8: PIN HEADER
L1-0S = Computer2:PF0560.103NLT: Fixed Inductors INDUCTOR PWR SHIELD 10UH SMD https://www.mouser.com/ProductDetail/Pulse-Electronics/PF0560103NLT?qs=sGAEpiMZZMsg%252By3WlYCkU%252BCbm%2FyM2yLshO29DWrNRHI%3D
L1-2P = SamacSys_Parts:XFL4020-102MEB: Fixed Inductors XFL4020 AEC-Q200 1 uH 20% 11 A Compos Source: Datasheet <https://componentsearchengine.com/Datasheets/1/XFL4020-102MEB.pdf>; DESCRIPTION: Fixed Inductors XFL4020 AEC-Q200 1 uH 20% 11 A Compos; HEIGHT: mm; MANUFACTURER_NAME: COILCRAFT; MANUFACTURER_PART_NUMBER: XFL4020-102MEB; MOUSER_PART_NUMBER: 994-XFL4020-102MEB; MOUSER_PRICE-STOCK: https://www.mouser.com/Search/Refine.aspx?Keyword=994-XFL4020-102MEB
L1-9P = SamacSys_Parts:LQM21PH2R2NGCD: LQM21PH_GC Series Inductor 2.2uH +/-30% 0805 (2012) Source: Datasheet <https://componentsearchengine.com/Datasheets/1/LQM21PH2R2NGCD.pdf>; DESCRIPTION: LQM21PH_GC Series Inductor 2.2uH +/-30% 0805 (2012); HEIGHT: 1mm; MANUFACTURER_NAME: Murata Electronics; MANUFACTURER_PART_NUMBER: LQM21PH2R2NGCD; MOUSER_PART_NUMBER: 81-LQM21PH2R2NGCD; MOUSER_PRICE-STOCK: https://www.mouser.com/Search/Refine.aspx?Keyword=81-LQM21PH2R2NGCD
LS1-C = Computer2:ASI09N27M-05Q
Q1-5P Q1-6P = SamacSys_Parts:SI7232DN-T1-GE3: Trans MOSFET N-CH 20V 10An Vishay SI7232DN-T1-GE3 Dual N-channel MOSFET Transistor, 24 A, 20 V, 8-Pin PowerPAK 1212 Source: Datasheet <https://componentsearchengine.com/Datasheets/1/SI7232DN-T1-GE3.pdf>; DESCRIPTION: Trans MOSFET N-CH 20V 10An Vishay SI7232DN-T1-GE3 Dual N-channel MOSFET Transistor, 24 A, 20 V, 8-Pin PowerPAK 1212; HEIGHT: mm; MANUFACTURER_NAME: Vishay; MANUFACTURER_PART_NUMBER: SI7232DN-T1-GE3; MOUSER_PART_NUMBER: 781-SI7232DN-GE3; MOUSER_PRICE-STOCK: https://www.mouser.com/Search/Refine.aspx?Keyword=781-SI7232DN-GE3
Q1-LS1C = Flight Computer Parts:NPN_TRANSISTOR
R0-0C R0A-C R0B-C R0C-C R1-0C R1-2C R1-5P R1-6P R1-J1C R1-J2C R1A-C R1B-C R2-2C R2-5P R2-6P R2-J1C R2-J2C R2A-C R2B-C R3-2C R3-5P R3-6P R3-C R3-J1C R3-J2C R4-2C R4-5P R4-6P R4-C R4-J1C R5-5P R5-6P R5-C R6-5P R6-6P R6-C R7-5P R7-6P R8-5P R8-6P = rcl:R-US_: RESISTOR, American symbol; SPICEPREFIX: R
R1-1P R1-1S R1-2P R1-2S R1-3S R1-4S R1-9P R1-11P R1-LS1C R1A-S R1B-S R2-1P R2-1S R2-2P R2-2S R2-3S R2-4S R2-9P R2-11P R2-LS1C R2A-S R2B-S R3-2S R3-4S R3-9P R3-LS1C R4-9P = resistor:R-US_: RESISTOR, American symbol
R3-11P R4-11P = PulseOximeterECG_AU:R-US_: RESISTOR, American symbol; SPICEPREFIX: R
S0-0C S1-0C = switch-omron:10-XX: OMRON SWITCH; MPN: B3F-1000; OC_FARNELL: 176432; OC_NEWARK: 36M3542
S1-P = adafruit:EG1218: SLIDING SWITCH 0.1" spacing through hole, vertical SPDT slide switch http://www.ladyada.net/library/pcb/eaglelibrary.html
U0-C = SamacSys_Parts:STM32F429ZIT6: 32-Bit MCU+FPU M4 2MB LCD-TFT LQFP144 STMicroelectronics STM32F429ZIT6, 32bit ARM Cortex M4 MCU, 180MHz, 2048 kB Flash, 144-Pin LQFP Source: Datasheet <https://componentsearchengine.com/Datasheets/1/STM32F429ZIT6.pdf>; DESCRIPTION: 32-Bit MCU+FPU M4 2MB LCD-TFT LQFP144 STMicroelectronics STM32F429ZIT6, 32bit ARM Cortex M4 MCU, 180MHz, 2048 kB Flash, 144-Pin LQFP; HEIGHT: 1.6mm; MANUFACTURER_NAME: STMicroelectronics; MANUFACTURER_PART_NUMBER: STM32F429ZIT6; MOUSER_PART_NUMBER: 511-STM32F429ZIT6; MOUSER_PRICE-STOCK: https://www.mouser.com/Search/Refine.aspx?Keyword=511-STM32F429ZIT6
U0-S = Computer2:TPS62202: 1.8-V Output, 300-mA, 95% Efficient Step-Down Converter in SOT-23 http://www.ti.com/product/TPS62202
U1-C = SamacSys_Parts:TC58CVG2S0HRAIJ: NAND Flash 4G-bit 128M X 8bit Serial 8-Pin WSON Source: Datasheet <https://business.kioxia.com/en-us/memory/detail.TC58CVG2S0HRAIJ.html>; DESCRIPTION: NAND Flash 4G-bit 128M X 8bit Serial 8-Pin WSON; HEIGHT: 0.8mm; MANUFACTURER_NAME: Kioxia America; MANUFACTURER_PART_NUMBER: TC58CVG2S0HRAIJ; MOUSER_PART_NUMBER: 757-TC58CVG2S0HRAIJ; MOUSER_PRICE-STOCK: https://www.mouser.co.uk/ProductDetail/Kioxia-America/TC58CVG2S0HRAIJ?qs=OlC7AqGiEDkQEWU%2FaAG3Ug%3D%3D
U1-P = SamacSys_Parts:MCP73831T-2ACI_OT: Li-Ion Charge Controller 4.2V SOT23-5 Source: Datasheet <https://componentsearchengine.com/Datasheets/1/MCP73831T-2ACI_OT.pdf>; DESCRIPTION: Li-Ion Charge Controller 4.2V SOT23-5; HEIGHT: 1.45mm; MANUFACTURER_NAME: Microchip; MANUFACTURER_PART_NUMBER: MCP73831T-2ACI/OT; MOUSER_PART_NUMBER: 579-MCP73831T-2ACIOT; MOUSER_PRICE-STOCK: https://www.mouser.com/Search/Refine.aspx?Keyword=579-MCP73831T-2ACIOT
U1-S = Computer2:ICM-20948: 9 Axis Motion Sensor from TDK InvenSense https://store.invensense.com/products/detail/ICM20948-InvenSense/597203/
U2-C = SamacSys_Parts:ADS1015BQDGSRQ1: Automotive 12-Bit 3.3kSPS 4-Ch Delta-Sigma ADC With PGA, Oscillator, VREF, Comparator, and I2C Source: Datasheet <http://www.ti.com/lit/gpn/ads1015-q1>; DESCRIPTION: Automotive 12-Bit 3.3kSPS 4-Ch Delta-Sigma ADC With PGA, Oscillator, VREF, Comparator, and I2C; HEIGHT: 1.1mm; MANUFACTURER_NAME: Texas Instruments; MANUFACTURER_PART_NUMBER: ADS1015BQDGSRQ1; MOUSER_PART_NUMBER: 595-ADS1015BQDGSRQ1; MOUSER_PRICE-STOCK: https://www.mouser.com/Search/Refine.aspx?Keyword=595-ADS1015BQDGSRQ1
U2-P = SamacSys_Parts:ISL91110IRAZ-T7A: Integrated FET Regulators High Current Buck Boost Switching Regulator Delivering 2A of Continuous Output Current Source: Datasheet <https://www.renesas.com/en-us/www/doc/datasheet/isl91110ir.pdf>; DESCRIPTION: Integrated FET Regulators High Current Buck Boost Switching Regulator Delivering 2A of Continuous Output Current; HEIGHT: 1mm; MANUFACTURER_NAME: Renesas Electronics; MANUFACTURER_PART_NUMBER: ISL91110IRAZ-T7A
U2-S = Computer2:MMA1211KEG
U3-S = Computer2:MS5607
U4-S = Computer2:FGPMMOPA6H
U7-P U8-P = SamacSys_Parts:LM293DR: Dual differential comparator, industrial grade Source: Datasheet <http://www.ti.com/lit/gpn/lm293>; DESCRIPTION: Dual differential comparator, industrial grade; HEIGHT: 1.75mm; MANUFACTURER_NAME: Texas Instruments; MANUFACTURER_PART_NUMBER: LM293DR; MOUSER_PART_NUMBER: 595-LM293DR; MOUSER_PRICE-STOCK: https://www.mouser.com/Search/Refine.aspx?Keyword=595-LM293DR
U9-P = SamacSys_Parts:LM3671MFX-ADJ_NOPB: 2MHz, 600mA Step-Down DC-DC Converter Source: Datasheet <http://www.ti.com/lit/gpn/lm3671>; DESCRIPTION: 2MHz, 600mA Step-Down DC-DC Converter; HEIGHT: 1.45mm; MANUFACTURER_NAME: Texas Instruments; MANUFACTURER_PART_NUMBER: LM3671MFX-ADJ/NOPB; MOUSER_PART_NUMBER: 926-LM3671MFXADJNOPB; MOUSER_PRICE-STOCK: https://www.mouser.com/Search/Refine.aspx?Keyword=926-LM3671MFXADJNOPB
U11-S U12-S U13-S U14-S = Computer2:SN74LV1T34: Single Power Supply BUFFER Logic Level Shifter
VR1-LS1C = pot:TRIM_US-: POTENTIOMETER
Y1-C = crystal-geyer_V1_0:KX: Quartz Crystals (MHz) SMD: KX - Serie Model Size l/w/h [mm] Frequency Range Frequency Stability Temp. Range [°C] Load Capacitance AECQ 200 availabel Datasheet KX-4 KX-5 KX-6 KX-7 KX-9A KX-9B KX-12A KX-12B KX-13 KX-20 KX-K KX-KS 1.6/1.2/0.3 2.0/1.6/0.45 2.5/2.0/0.55 3.2/2.5/0.8 5.0/3.2/1.0 5.0/3.2/1.1 6.0/3.5/1.1 6.0/3.5/1.0 7.0/5.0 /1.3 11.6/5.5/1.6 12.3/4.5/4.2 12.3/4.5/3.2 24.0 ~ 80.0 MHz 16.0 ~ 80.0 MHz 12.0 ~ 80.0 MHz 8.0 ~ 60.0 MHz 7,68 ~ 300,0 MHz 8,0 ~ 50,0 MHz 8,0 ~ 150,0 MHz 8,0 ~ 50,0 MHz 6,0 ~ 160,0 MHz 3,579 ~ 25,0 MHz 3,579 ~ 70,0 MHz 3,579 ~ 70,0 MHz ±10 … ±50ppm ±10 … ±50ppm ±10 … ±50ppm ±10 … ±50ppm ±10 … ±50ppm ±10 … ±50ppm ±10 … ±50ppm ±10 … ±50ppm ±10 … ±50ppm ±50ppm ±10 … ±50ppm ±10 … ±50ppm (*) -40°C …+85°C (*) -40°C …+125°C (*) -40°C …+125°C (*) -40°C …+125°C (*) -40°C …+105°C (*) -40°C …+105°C (*) -40°C …+125°C (*) -40°C …+105°C (*) -40°C …+105°C (*) -40°C …+105°C (*) -40°C …+85°C (*) -40°C …+85°C 8, 8…16 8, 8…16 10, 8…16 12, 7…20 16, 10…20 16, 10…20 16, 10…20 16, 12…20 16, 12…20 16, 12…20 16, 12…30 16, 12…30 - yes yes yes - - - - - - - - KX-4.pdf <http://www.geyer-electronic.de/uploads/tx_userartikelfrequenz/GEYER-KX-4.pdf> KX-5.pdf <http://www.geyer-electronic.de/uploads/tx_userartikelfrequenz/GEYER-KX-5.pdf> KX-6.pdf <http://www.geyer-electronic.de/uploads/tx_userartikelfrequenz/GEYER-KX-6.pdf> KX-7.pdf <http://www.geyer-electronic.de/uploads/tx_userartikelfrequenz/GEYER-KX-7.pdf> KX-9A.pdf <http://www.geyer-electronic.de/uploads/tx_userartikelfrequenz/GEYER-KX-9A.pdf> KX-9B.pdf <http://www.geyer-electronic.de/uploads/tx_userartikelfrequenz/GEYER-KX-9B.pdf> KX-12A.pdf <http://www.geyer-electronic.de/uploads/tx_userartikelfrequenz/GEYER-KX-12A.pdf> KX-12B.pdf <http://www.geyer-electronic.de/uploads/tx_userartikelfrequenz/GEYER-KX-12B.pdf> KX-13.pdf <http://www.geyer-electronic.de/uploads/tx_userartikelfrequenz/GEYER-KX-13.pdf> KX-20.pdf <http://www.geyer-electronic.de/uploads/tx_userartikelfrequenz/GEYER-KX-20.pdf> KX-K.pdf <http://www.geyer-electronic.de/uploads/tx_userartikelfrequenz/GEYER-KX-K.pdf> KX-KS.pdf <http://www.geyer-electronic.de/uploads/tx_userartikelfrequenz/GEYER-KX-KS.pdf> <http://www.geyer-electronic.de/fileadmin/template/img/logo-geyer-electronic.png> Details see: http://www.geyer-electronic.de/Frequenz-Produkte.9.0.html Created 2016-06-07, Hans Locher 2016 (C) Geyer Quartz Technology KX4,KX5,KX6,KX7,KX9A,KX9B,KX12A,KX12B,KX13,KX20,KXK,KXKS;1612;2016;2520;3225;5032;6035;7050;11655;12345;1,6x1,2;2,0x1,6;2,5x2,0;3,2x2,5;5,0x3,2;6,0x3,5;7,0x5,0;11,6x5,5;12,3x4,5;12,3x4,5;1.6x1.2;2.0x1.6;2.5x2.0;3.2x2.5;5.0x3.2;6.0x3.5;7.0x5.0;11.6x5.5;12.3x4.5;12.3x4.5;

## Board
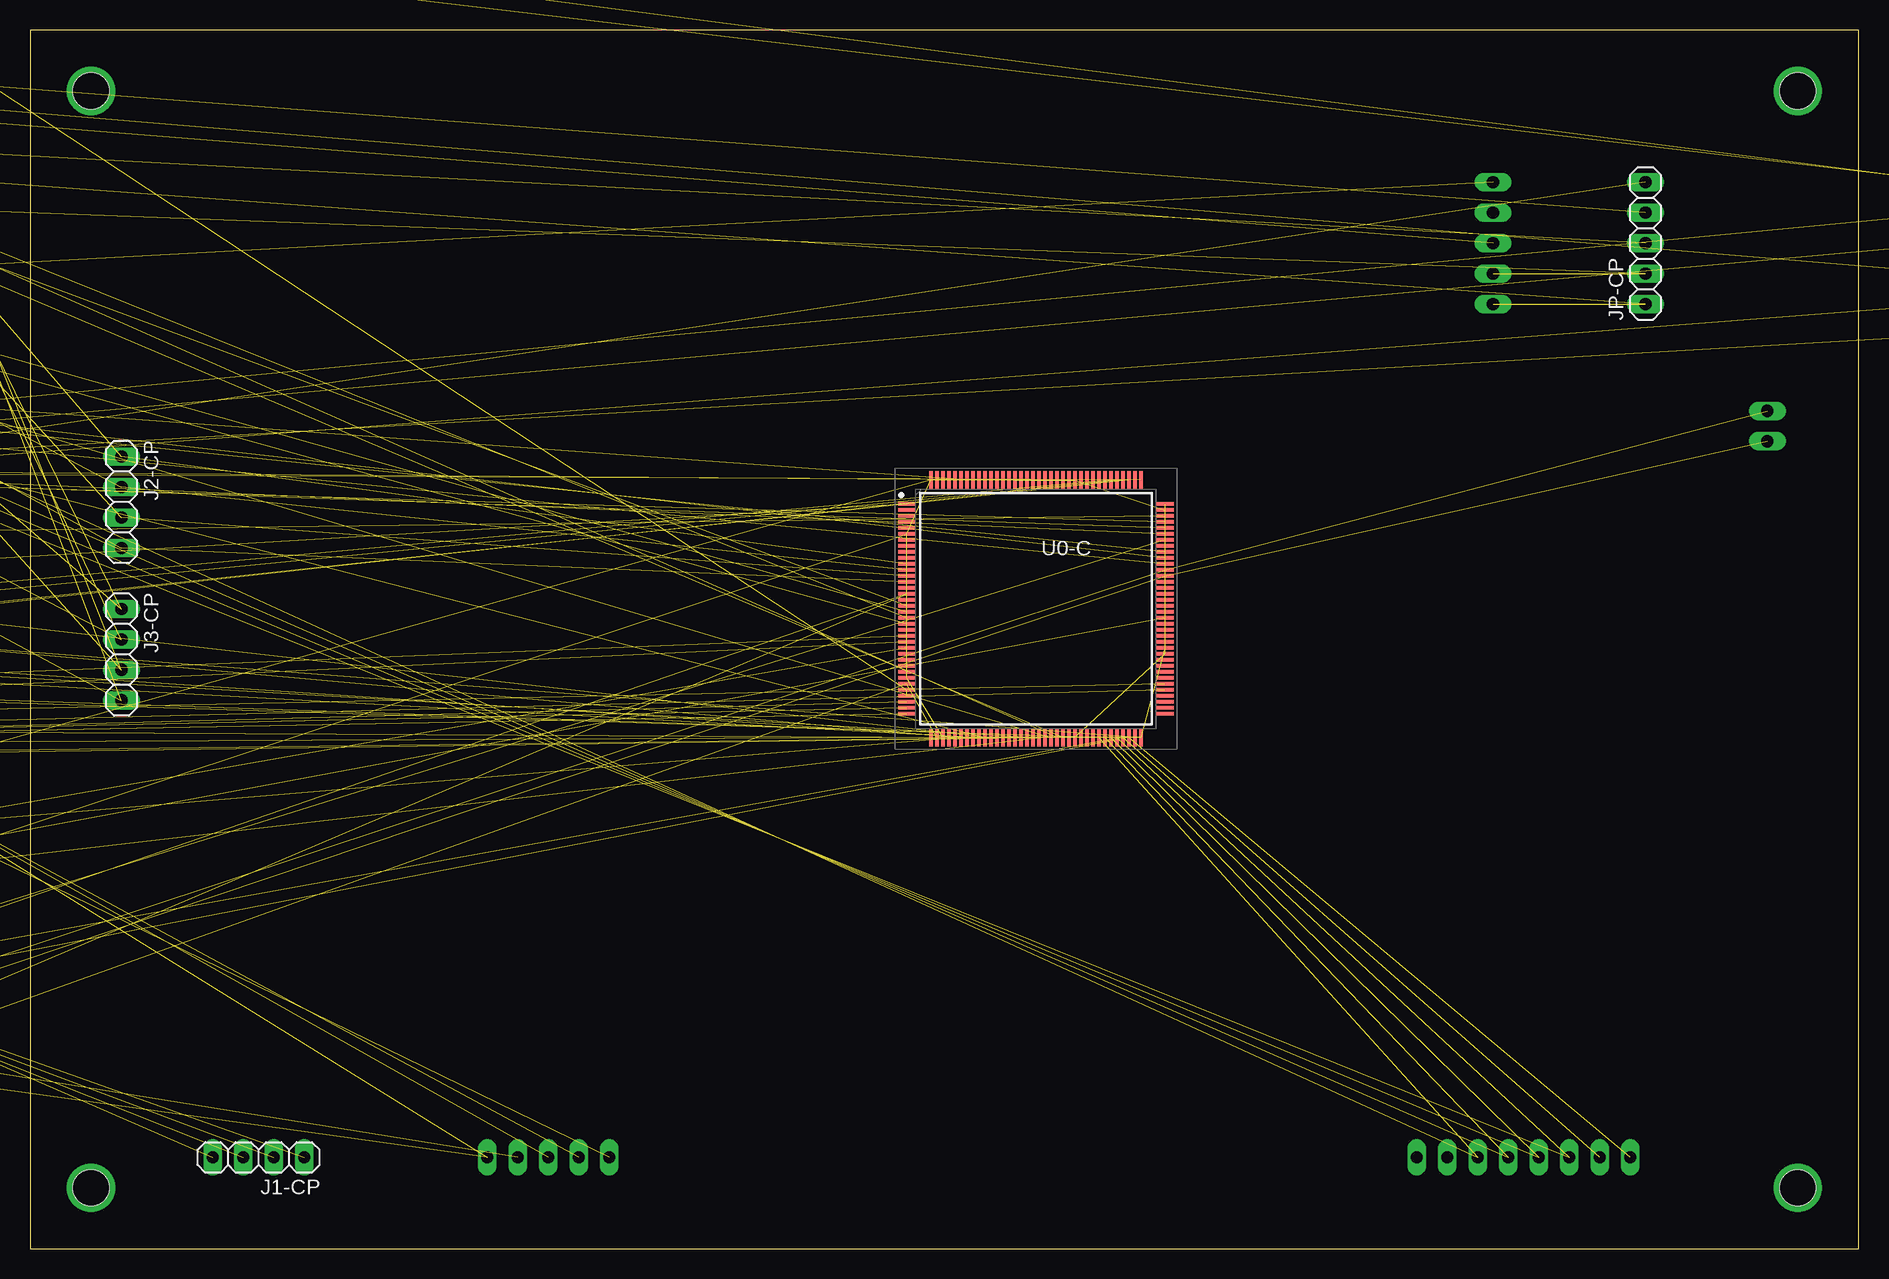
[diagram p5: board, top side]
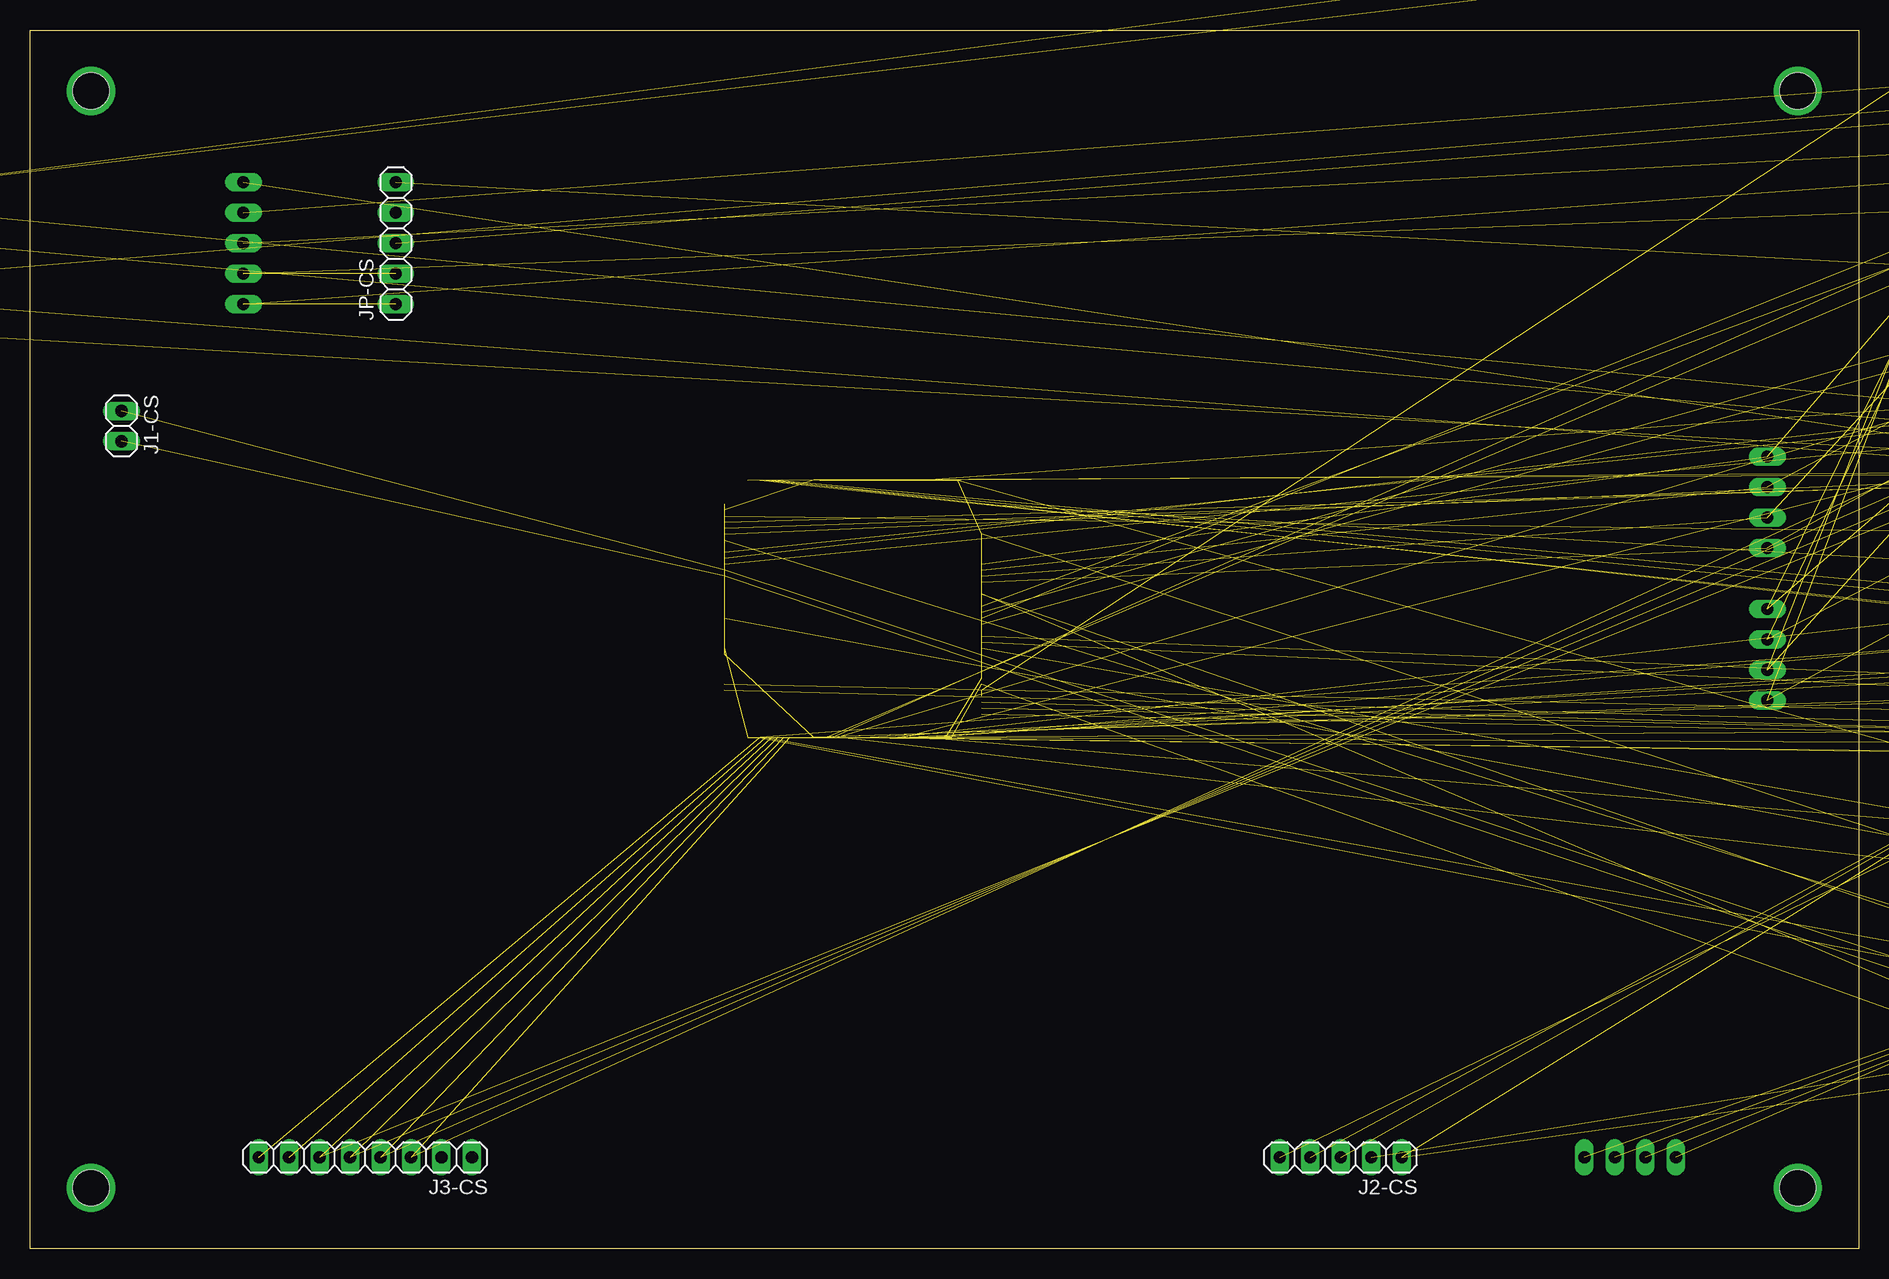
[diagram p6: board, bottom side, seen from below]

Size 152.4 x 101.6 mm. Coordinates in mm from the lower left corner, seen from the top.
Outline: 0,0 152.4,0 152.4,101.6 0,101.6 0,0
Copper layers (1*16): Top 0.035mm / dielectric 1.5mm / Bottom 0.035mm
Design rules "default": minimum track width 6mil, minimum drill 0.35mm, track to track 6mil, track to pad 6mil, pad to pad 6mil, via to via 6mil, smd to smd 6mil, copper to edge 40mil, drill to drill 6mil, minimum pad ring 10mil, minimum via ring 8mil, stop-mask expansion 4mil, vias tented up to drill 0mil, thermal gap 10mil
Holes 3 mm at 5.08,96.52 147.32,96.52 147.32,5.08 5.08,5.08

### Footprints (pad centres in the part's own frame; a part is rotated, then mirrored left to right if it is on the bottom)
1725656 = drill 1.1 pad 1.65: 1 -1.27,3.1; 2 1.27,3.1 | hole 1.1: -1.27,0.56; 1.27,0.56
A1JB = smd 0.6 x 1.4: 1 1.525,0; 3 -1.525,0 | smd 2.2 x 1.05: 2 0,1.475; 4 0,-1.475
C0805 = smd 1.3 x 1.5: 1 -0.95,0; 2 0.95,0
C0805' = smd 1.3 x 1.5: 1 -0.85,0; 2 0.85,0
CHIPLED_0805 = smd 1.2 x 1.2: A 0,-1.05; C 0,1.05
POWERDI_123 = smd 2.2 x 1.4: 1 -1.6,0 | smd 0.9 x 1.4: 2 0.95,0
BEADC2012X105N = smd 1.2 x 1.45: 1 -0.85,0; 2 0.85,0
2X8 = drill 1.016 pad 1.88: 1 0,0; 2 0,2.54; 3 2.54,0; 4 2.54,2.54; 5 5.08,0; 6 5.08,2.54; 7 7.62,0; 8 7.62,2.54; 9 10.16,0; 10 10.16,2.54; 11 12.7,0; 12 12.7,2.54; 13 15.24,0; 14 15.24,2.54; 15 17.78,0; 16 17.78,2.54
1X06 = drill 1.016 long: 1 -6.35,0; 2 -3.81,0; 3 -1.27,0; 4 1.27,0; 5 3.81,0; 6 6.35,0
1X04 = drill 1.016 long: 1 -3.81,0; 2 -1.27,0; 3 1.27,0; 4 3.81,0
1X02 = drill 1.016 long: 1 -1.27,0; 2 1.27,0
TE_2134441-2 = smd 1.4 x 0.4: 1 -4.45,1.3; 2 -4.45,0.65; 3 -4.45,0; 4 -4.45,-0.65; 5 -4.45,-1.3 | drill 0.8 pad 1.25 long: S1 -4,-4.875; S2 0,-4.875; S3 0,4.875; S4 -4,4.875
1X05 = drill 1.016 long: 1 -5.08,0; 2 -2.54,0; 3 0,0; 4 2.54,0; 5 5.08,0
1725711 = drill 1.1 pad 1.65: 1 -8.89,0; 2 -6.35,0; 3 -3.81,0; 4 -1.27,0; 5 1.27,0; 6 3.81,0; 7 6.35,0; 8 8.89,0
1X08 = drill 1.016 long: 1 -8.89,0; 2 -6.35,0; 3 -3.81,0; 4 -1.27,0; 5 1.27,0; 6 3.81,0; 7 6.35,0; 8 8.89,0
PF0560NL = smd 3.81 x 1.93: P$1 0,-4.5; P$2 0,4.5
XFL4020 = smd 0.98 x 3.4: 1 -1.185,0; 2 1.185,0
INDC2012X100N = smd 1.1 x 1.45: 1 -0.9,0; 2 0.9,0
ASI09N27M-05Q = smd 2.184 x 1.067: V+ 3.81,0; V- -3.81,0
POWERPAK-1212-8 = smd 0.99 x 0.405: 1 -1.435,0.99; 2 -1.435,0.33; 3 -1.435,-0.33; 4 -1.435,-0.99; 5 1.435,-0.99; 6 1.435,-0.33; 7 1.435,0.33; 8 1.435,0.99 | smd 1.725 x 2.235: 9 0.557,0
SOT23 = smd 1 x 1.4: 1 -0.95,-1.1; 2 0.95,-1.1; 3 0,1.1
R0805 = smd 1.3 x 1.5: 1 -0.95,0; 2 0.95,0
M0805 = smd 1.3 x 1.6: 1 -0.95,0; 2 0.95,0
B3F-10XX = drill 1.016 long: 1 -3.251,2.261; 2 3.251,2.261; 3 -3.251,-2.261; 4 3.251,-2.261
EG1218 = drill 0.9 pad 1.676: O -2.54,0; P 0,0; S 2.54,0
QFP50P2200X2200X160-144N = smd 1.475 x 0.3: 1 -10.738,8.75; 2 -10.738,8.25; 3 -10.738,7.75; 4 -10.738,7.25; 5 -10.738,6.75; 6 -10.738,6.25; 7 -10.738,5.75; 8 -10.738,5.25; 9 -10.738,4.75; 10 -10.738,4.25; 11 -10.738,3.75; 12 -10.738,3.25; 13 -10.738,2.75; 14 -10.738,2.25; 15 -10.738,1.75; 16 -10.738,1.25; 17 -10.738,0.75; 18 -10.738,0.25; 19 -10.738,-0.25; 20 -10.738,-0.75; 21 -10.738,-1.25; 22 -10.738,-1.75; 23 -10.738,-2.25; 24 -10.738,-2.75; 25 -10.738,-3.25; 26 -10.738,-3.75; 27 -10.738,-4.25; 28 -10.738,-4.75; 29 -10.738,-5.25; 30 -10.738,-5.75; 31 -10.738,-6.25; 32 -10.738,-6.75; 33 -10.738,-7.25; 34 -10.738,-7.75; 35 -10.738,-8.25; 36 -10.738,-8.75; 73 10.738,-8.75; 74 10.738,-8.25; 75 10.738,-7.75; 76 10.738,-7.25; 77 10.738,-6.75; 78 10.738,-6.25; 79 10.738,-5.75; 80 10.738,-5.25; 81 10.738,-4.75; 82 10.738,-4.25; 83 10.738,-3.75; 84 10.738,-3.25; 85 10.738,-2.75; 86 10.738,-2.25; 87 10.738,-1.75; 88 10.738,-1.25; 89 10.738,-0.75; 90 10.738,-0.25; 91 10.738,0.25; 92 10.738,0.75; 93 10.738,1.25; 94 10.738,1.75; 95 10.738,2.25; 96 10.738,2.75; 97 10.738,3.25; 98 10.738,3.75; 99 10.738,4.25; 100 10.738,4.75; 101 10.738,5.25; 102 10.738,5.75; 103 10.738,6.25; 104 10.738,6.75; 105 10.738,7.25; 106 10.738,7.75; 107 10.738,8.25; 108 10.738,8.75 | smd 0.3 x 1.475: 37 -8.75,-10.738; 38 -8.25,-10.738; 39 -7.75,-10.738; 40 -7.25,-10.738; 41 -6.75,-10.738; 42 -6.25,-10.738; 43 -5.75,-10.738; 44 -5.25,-10.738; 45 -4.75,-10.738; 46 -4.25,-10.738; 47 -3.75,-10.738; 48 -3.25,-10.738; 49 -2.75,-10.738; 50 -2.25,-10.738; 51 -1.75,-10.738; 52 -1.25,-10.738; 53 -0.75,-10.738; 54 -0.25,-10.738; 55 0.25,-10.738; 56 0.75,-10.738; 57 1.25,-10.738; 58 1.75,-10.738; 59 2.25,-10.738; 60 2.75,-10.738; 61 3.25,-10.738; 62 3.75,-10.738; 63 4.25,-10.738; 64 4.75,-10.738; 65 5.25,-10.738; 66 5.75,-10.738; 67 6.25,-10.738; 68 6.75,-10.738; 69 7.25,-10.738; 70 7.75,-10.738; 71 8.25,-10.738; 72 8.75,-10.738; 109 8.75,10.738; 110 8.25,10.738; 111 7.75,10.738; 112 7.25,10.738; 113 6.75,10.738; 114 6.25,10.738; 115 5.75,10.738; 116 5.25,10.738; 117 4.75,10.738; 118 4.25,10.738; 119 3.75,10.738; 120 3.25,10.738; 121 2.75,10.738; 122 2.25,10.738; 123 1.75,10.738; 124 1.25,10.738; 125 0.75,10.738; 126 0.25,10.738; 127 -0.25,10.738; 128 -0.75,10.738; 129 -1.25,10.738; 130 -1.75,10.738; 131 -2.25,10.738; 132 -2.75,10.738; 133 -3.25,10.738; 134 -3.75,10.738; 135 -4.25,10.738; 136 -4.75,10.738; 137 -5.25,10.738; 138 -5.75,10.738; 139 -6.25,10.738; 140 -6.75,10.738; 141 -7.25,10.738; 142 -7.75,10.738; 143 -8.25,10.738; 144 -8.75,10.738
SOT95P280X145-5 = smd 1.259 x 0.609: 1 -1.228,0.95; 2 -1.228,0; 3 -1.228,-0.95; 4 1.228,-0.95; 5 1.228,0.95
SON127P800X600X80-9N = smd 0.95 x 0.45: 1 -3.9,1.905; 2 -3.9,0.635; 3 -3.9,-0.635; 4 -3.9,-1.905; 5 3.9,-1.905; 6 3.9,-0.635; 7 3.9,0.635; 8 3.9,1.905 | smd 3.5 x 4.4: 9 0,0
SOT95P270X145-5N = smd 1.4 x 0.6: 1 -1.25,0.95; 2 -1.25,0; 3 -1.25,-0.95; 4 1.25,-0.95; 5 1.25,0.95
QFN40P300X300X105-25T159X175 = smd 0.738 x 0.22: 1 -1.496,1; 2 -1.496,0.6; 3 -1.496,0.2; 4 -1.496,-0.2; 5 -1.496,-0.6; 6 -1.496,-1; 13 1.496,-1; 14 1.496,-0.6; 15 1.496,-0.2; 16 1.496,0.2; 17 1.496,0.6; 18 1.496,1 | smd 0.22 x 0.738: 7 -1,-1.496; 8 -0.6,-1.496; 9 -0.2,-1.496; 10 0.2,-1.496; 11 0.6,-1.496; 12 1,-1.496; 19 1,1.496; 20 0.6,1.496; 21 0.2,1.496; 22 -0.2,1.496; 23 -0.6,1.496; 24 -1,1.496 | smd 1.59 x 1.75: 25 0,0
SOP50P490X110-10N = smd 1.4 x 0.3: 1 -2.2,1; 2 -2.2,0.5; 3 -2.2,0; 4 -2.2,-0.5; 5 -2.2,-1; 6 2.2,-1; 7 2.2,-0.5; 8 2.2,0; 9 2.2,0.5; 10 2.2,1
QFN50P400X400X100-21N = smd 0.75 x 0.3: 1 -2,1; 2 -2,0.5; 3 -2,0; 4 -2,-0.5; 5 -2,-1; 11 2,-1; 12 2,-0.5; 13 2,0; 14 2,0.5; 15 2,1 | smd 0.3 x 0.75: 6 -1,-2; 7 -0.5,-2; 8 0,-2; 9 0.5,-2; 10 1,-2; 16 1,2; 17 0.5,2; 18 0,2; 19 -0.5,2; 20 -1,2 | smd 2.85 x 2.85: 21 0,0
SOIC127P1041X355-16N = smd 1.973 x 0.589: 1 -4.705,4.445; 2 -4.705,3.175; 3 -4.705,1.905; 4 -4.705,0.635; 5 -4.705,-0.635; 6 -4.705,-1.905; 7 -4.705,-3.175; 8 -4.705,-4.445; 9 4.705,-4.445; 10 4.705,-3.175; 11 4.705,-1.905; 12 4.705,-0.635; 13 4.705,0.635; 14 4.705,1.905; 15 4.705,3.175; 16 4.705,4.445
MS5607 = smd 1.1 x 0.6: P$1 -1.1,1.875; P$2 -1.1,0.625; P$3 -1.1,-0.625; P$4 -1.1,-1.875; P$5 1.1,-1.875; P$6 1.1,-0.625; P$7 1.1,0.625; P$8 1.1,1.875
SOIC127P1800X470-20N = smd 2.54 x 1.016: 1 -8.1,5.715; 2 -8.1,4.445; 3 -8.1,3.175; 4 -8.1,1.905; 5 -8.1,0.635; 6 -8.1,-0.635; 7 -8.1,-1.905; 8 -8.1,-3.175; 9 -8.1,-4.445; 10 -8.1,-5.715; 11 8.1,-5.715; 12 8.1,-4.445; 13 8.1,-3.175; 14 8.1,-1.905; 15 8.1,-0.635; 16 8.1,0.635; 17 8.1,1.905; 18 8.1,3.175; 19 8.1,4.445; 20 8.1,5.715
SOIC127P600X175-8N = smd 1.525 x 0.65: 1 -2.712,1.905; 2 -2.712,0.635; 3 -2.712,-0.635; 4 -2.712,-1.905; 5 2.712,-1.905; 6 2.712,-0.635; 7 2.712,0.635; 8 2.712,1.905
SOT95P280X145-5N = smd 1.2 x 0.6: 1 -1.25,0.95; 2 -1.25,0; 3 -1.25,-0.95; 4 1.25,-0.95; 5 1.25,0.95
SOT65P210X110-5 = smd 1.186 x 0.397: 1 -0.962,0.65; 2 -0.962,0; 3 -0.962,-0.65; 4 0.962,-0.65; 5 0.962,0.65
LI10 = drill 1.321 octagon: A -2.54,-5.08; E 2.54,-5.08; S 0,5.08
3.2X2.5_KX-7 = smd 1.3 x 1.1: 1 -1.15,-0.9; 2 1.15,-0.9; 3 1.15,0.9; 4 -1.15,0.9

### Placement (x,y rotation side)
1S_LIPO  -80.01,26.67 0 top  (outside the outline)
AT1-S  -44.45,102.87 0 top  (outside the outline)
C1  -27.94,102.87 0 top  (outside the outline)
C1-0C  -40.64,83.82 0 top  (outside the outline)
C1-0S  -115.57,83.82 0 top  (outside the outline)
C1-1P  -17.78,90.17 0 top  (outside the outline)
C1-1S  -24.13,90.17 0 top  (outside the outline)
C1-2C  -48.26,83.82 0 top  (outside the outline)
C1-2P  -30.48,90.17 0 top  (outside the outline)
C1-2S  -86.36,77.47 0 top  (outside the outline)
C1-3S  -36.83,90.17 0 top  (outside the outline)
C1-9P  -43.18,90.17 0 top  (outside the outline)
C1-11P  -80.01,64.77 0 top  (outside the outline)
C1-C  -106.68,96.52 0 top  (outside the outline)
C2  -33.02,102.87 0 top  (outside the outline)
C2-0C  -55.88,83.82 0 top  (outside the outline)
C2-0S  -49.53,90.17 0 top  (outside the outline)
C2-1P  -55.88,90.17 0 top  (outside the outline)
C2-1S  -62.23,90.17 0 top  (outside the outline)
C2-2P  10uF  [C0805']  -116.84,102.87 0 top  (outside the outline)
C2-2S  -68.58,90.17 0 top  (outside the outline)
C2-9P  -74.93,90.17 0 top  (outside the outline)
C3-0C  -63.5,83.82 0 top  (outside the outline)
C3-1S  -81.28,90.17 0 top  (outside the outline)
C3-2P  -87.63,90.17 0 top  (outside the outline)
C3-9P  -93.98,90.17 0 top  (outside the outline)
C4-0C  -71.12,83.82 0 top  (outside the outline)
C4-2P  -100.33,90.17 0 top  (outside the outline)
C4-9P  -106.68,90.17 0 top  (outside the outline)
C5-0C  -78.74,83.82 0 top  (outside the outline)
C5-2P  22pF  [C0805']  -17.78,109.22 0 top  (outside the outline)
C6-0C  -86.36,83.82 0 top  (outside the outline)
C7-0C  -93.98,83.82 0 top  (outside the outline)
C8-0C  -101.6,83.82 0 top  (outside the outline)
C9-0C  -109.22,83.82 0 top  (outside the outline)
C10-0C  -73.66,58.42 0 top  (outside the outline)
C11-0C  -72.39,64.77 0 top  (outside the outline)
C12-0C  -81.28,58.42 0 top  (outside the outline)
C13-0C  -88.9,58.42 0 top  (outside the outline)
C14-0C  -96.52,58.42 0 top  (outside the outline)
C15-0C  -104.14,58.42 0 top  (outside the outline)
C16-0C  -111.76,58.42 0 top  (outside the outline)
C17-0C  -119.38,58.42 0 top  (outside the outline)
D0A-C  -64.77,49.53 0 top  (outside the outline)
D0B-C  -71.12,49.53 0 top  (outside the outline)
D0C-C  -16.51,49.53 0 top  (outside the outline)
D1-1P  -50.8,101.6 0 top  (outside the outline)
D1-1S  -57.15,101.6 0 top  (outside the outline)
D1-2S  -63.5,101.6 0 top  (outside the outline)
D1-3S  -69.85,101.6 0 top  (outside the outline)
D1-4S  -76.2,101.6 0 top  (outside the outline)
D1-11P  -97.79,119.38 0 top  (outside the outline)
D1A-C  -43.18,41.91 0 top  (outside the outline)
D1A-S  -83.82,49.53 0 top  (outside the outline)
D1B-C  -49.53,41.91 0 top  (outside the outline)
D1B-S  -90.17,49.53 0 top  (outside the outline)
D2-1S  -82.55,101.6 0 top  (outside the outline)
D2-2S  -88.9,101.6 0 top  (outside the outline)
D2-3S  -95.25,101.6 0 top  (outside the outline)
D2-4S  -101.6,101.6 0 top  (outside the outline)
D2A-C  -55.88,41.91 0 top  (outside the outline)
D2A-S  -96.52,49.53 0 top  (outside the outline)
D2B-C  -77.47,49.53 0 top  (outside the outline)
D2B-S  -102.87,49.53 0 top  (outside the outline)
D3-4S  -38.1,101.6 0 top  (outside the outline)
D3-C  -62.23,26.67 0 top  (outside the outline)
D4-C  -107.95,101.6 0 top  (outside the outline)
D5-C  -73.66,114.3 0 top  (outside the outline)
D6-C  -80.01,114.3 0 top  (outside the outline)
FB1-0C  -45.72,124.46 0 top  (outside the outline)
J1-9P  -78.74,41.91 0 top  (outside the outline)
J1-C  160.02,82.55 270 top  (outside the outline)
J1-CP  19.05,7.62 180 top
J1-CS  144.78,68.58 270 bottom
J2-C  -59.69,10.16 0 top  (outside the outline)
J2-CP  7.62,62.23 270 top
J2-CS  43.18,7.62 180 bottom
J2-P  -49.53,50.8 0 top  (outside the outline)
J3-CP  7.62,49.53 270 top
J3-CS  124.46,7.62 180 bottom
JP-CP  134.62,83.82 90 top
JP-CS  121.92,83.82 90 bottom
L1-0S  -106.68,7.62 0 top  (outside the outline)
L1-2P  -93.98,114.3 0 top  (outside the outline)
L1-9P  -25.4,124.46 0 top  (outside the outline)
LS1-C  -81.28,8.89 0 top  (outside the outline)
Q1-5P  -63.5,120.65 0 top  (outside the outline)
Q1-6P  -80.01,120.65 0 top  (outside the outline)
Q1-LS1C  -36.83,43.18 0 top  (outside the outline)
R0-0C  -118.11,64.77 0 top  (outside the outline)
R0A-C  -101.6,77.47 0 top  (outside the outline)
R0B-C  -109.22,77.47 0 top  (outside the outline)
R0C-C  -93.98,77.47 0 top  (outside the outline)
R1-0C  -17.78,71.12 0 top  (outside the outline)
R1-1P  -55.88,71.12 0 top  (outside the outline)
R1-1S  -63.5,71.12 0 top  (outside the outline)
R1-2C  -25.4,71.12 0 top  (outside the outline)
R1-2P  -71.12,71.12 0 top  (outside the outline)
R1-2S  -78.74,71.12 0 top  (outside the outline)
R1-3S  -86.36,71.12 0 top  (outside the outline)
R1-4S  -93.98,71.12 0 top  (outside the outline)
R1-5P  -113.03,90.17 0 top  (outside the outline)
R1-6P  -119.38,90.17 0 top  (outside the outline)
R1-9P  -101.6,71.12 0 top  (outside the outline)
R1-11P  -39.37,58.42 0 top  (outside the outline)
R1-J1C  -19.05,64.77 0 top  (outside the outline)
R1-J2C  -26.67,64.77 0 top  (outside the outline)
R1-LS1C  -114.3,50.8 0 top  (outside the outline)
R1A-C  -116.84,77.47 0 top  (outside the outline)
R1A-S  -87.63,64.77 0 top  (outside the outline)
R1B-C  -17.78,83.82 0 top  (outside the outline)
R1B-S  -95.25,64.77 0 top  (outside the outline)
R2-1P  -109.22,71.12 0 top  (outside the outline)
R2-1S  -116.84,71.12 0 top  (outside the outline)
R2-2C  -33.02,71.12 0 top  (outside the outline)
R2-2P  -17.78,77.47 0 top  (outside the outline)
R2-2S  -25.4,77.47 0 top  (outside the outline)
R2-3S  -33.02,77.47 0 top  (outside the outline)
R2-4S  -40.64,77.47 0 top  (outside the outline)
R2-5P  -17.78,96.52 0 top  (outside the outline)
R2-6P  -24.13,96.52 0 top  (outside the outline)
R2-9P  -48.26,77.47 0 top  (outside the outline)
R2-11P  -48.26,58.42 0 top  (outside the outline)
R2-J1C  -34.29,64.77 0 top  (outside the outline)
R2-J2C  -41.91,64.77 0 top  (outside the outline)
R2-LS1C  -20.32,58.42 0 top  (outside the outline)
R2A-C  -25.4,83.82 0 top  (outside the outline)
R2A-S  -102.87,64.77 0 top  (outside the outline)
R2B-C  -33.02,83.82 0 top  (outside the outline)
R2B-S  -110.49,64.77 0 top  (outside the outline)
R3-2C  -40.64,71.12 0 top  (outside the outline)
R3-2S  -55.88,77.47 0 top  (outside the outline)
R3-4S  -63.5,77.47 0 top  (outside the outline)
R3-5P  -30.48,96.52 0 top  (outside the outline)
R3-6P  -36.83,96.52 0 top  (outside the outline)
R3-9P  -71.12,77.47 0 top  (outside the outline)
R3-11P  -57.15,58.42 0 top  (outside the outline)
R3-C  -113.03,96.52 0 top  (outside the outline)
R3-J1C  -49.53,64.77 0 top  (outside the outline)
R3-J2C  -57.15,64.77 0 top  (outside the outline)
R3-LS1C  -30.48,58.42 0 top  (outside the outline)
R4-2C  -48.26,71.12 0 top  (outside the outline)
R4-5P  -43.18,96.52 0 top  (outside the outline)
R4-6P  -49.53,96.52 0 top  (outside the outline)
R4-9P  -78.74,77.47 0 top  (outside the outline)
R4-11P  -66.04,58.42 0 top  (outside the outline)
R4-C  -119.38,96.52 0 top  (outside the outline)
R4-J1C  -64.77,64.77 0 top  (outside the outline)
R5-5P  -55.88,96.52 0 top  (outside the outline)
R5-6P  -62.23,96.52 0 top  (outside the outline)
R5-C  -16.51,102.87 0 top  (outside the outline)
R6-5P  -68.58,96.52 0 top  (outside the outline)
R6-6P  -74.93,96.52 0 top  (outside the outline)
R6-C  -22.86,102.87 0 top  (outside the outline)
R7-5P  -81.28,96.52 0 top  (outside the outline)
R7-6P  -87.63,96.52 0 top  (outside the outline)
R8-5P  -93.98,96.52 0 top  (outside the outline)
R8-6P  -100.33,96.52 0 top  (outside the outline)
S0-0C  -33.02,30.48 0 top  (outside the outline)
S1-0C  -43.18,27.94 0 top  (outside the outline)
S1-P  -26.67,50.8 0 top  (outside the outline)
U0-C  83.82,53.34 0 top
U0-S  -71.12,29.21 0 top  (outside the outline)
U1-C  -111.76,43.18 0 top  (outside the outline)
U1-P  -38.1,120.65 0 top  (outside the outline)
U1-S  -53.34,29.21 0 top  (outside the outline)
U2-C  -22.86,120.65 0 top  (outside the outline)
U2-P  -62.23,115.57 0 top  (outside the outline)
U2-S  -93.98,7.62 0 top  (outside the outline)
U3-S  -35.56,50.8 0 top  (outside the outline)
U4-S  -46.99,11.43 0 top  (outside the outline)
U7-P  -25.4,109.22 0 top  (outside the outline)
U8-P  -35.56,109.22 0 top  (outside the outline)
U9-P  -49.53,120.65 0 top  (outside the outline)
U11-S  -90.17,29.21 0 top  (outside the outline)
U12-S  -102.87,29.21 0 top  (outside the outline)
U13-S  -115.57,29.21 0 top  (outside the outline)
U14-S  -19.05,43.18 0 top  (outside the outline)
VR1-LS1C  -21.59,33.02 0 top  (outside the outline)
Y1-C  -100.33,43.18 0 top  (outside the outline)

### Tracks (layer width: path | path; a pad name or v marks a point on that pad's centre or on a via)
1V8  (10 unrouted)
3D-FIX  (1 unrouted)
3V3  (57 unrouted)
5V  (16 unrouted)
ACCEL_ANALOG  (3 unrouted)
ADC-ERROR  (1 unrouted)
ADC_ALERT  (2 unrouted)
ADDR  (1 unrouted)
ARMED-LED  (3 unrouted)
BATT_MEAS  (3 unrouted)
BOOT0  (1 unrouted)
BUZZER_OUT  (1 unrouted)
CENTRAL-ERROR  (2 unrouted)
CENTRAL-NOMINAL  (2 unrouted)
CLK-1  (3 unrouted)
CLK-1V8  (1 unrouted)
CLK-3  (1 unrouted)
CMP_LDO_IN  (5 unrouted)
CMP_LDO_OUT_1  (2 unrouted)
CMP_LDO_OUT_2  (2 unrouted)
CMP_LDO_OUT_3  (2 unrouted)
CMP_LDO_OUT_4  (2 unrouted)
CMP_RAIL  (5 unrouted)
CS1  (2 unrouted)
CS1-1V8  (1 unrouted)
CS2  (3 unrouted)
CS-3  (1 unrouted)
CTS  (2 unrouted)
D0A-C_R0A-C  (1 unrouted)
D0B-C_R0B-C  (1 unrouted)
D0C-C_R0C-C  (1 unrouted)
D1-1P_R1-1P  (1 unrouted)
D1-1S_R1-1S  (1 unrouted)
D1-2S_R1-2S  (1 unrouted)
D1-3S_R1-3S  (1 unrouted)
D1-4S_R1-4S  (1 unrouted)
D1A-C_R1A-C  (1 unrouted)
D1A-S_R1A-S  (1 unrouted)
D1B-C_R1B-C  (1 unrouted)
D1B-S_R1B-S  (1 unrouted)
D2-1S_R2-1S  (1 unrouted)
D2-2S_R2-2S  (1 unrouted)
D2-3S_R2-3S  (1 unrouted)
D2-4S_R2-4S  (1 unrouted)
D2A-C_R2A-C  (1 unrouted)
D2A-S_R2A-S  (1 unrouted)
D2B-C_R2B-C  (1 unrouted)
D2B-S_R2B-S  (1 unrouted)
D3-4S_R3-4S  (1 unrouted)
D3-C_R3-C  (1 unrouted)
D4-C_R4-C  (1 unrouted)
D5-C_R5-C  (1 unrouted)
D6-C_R6-C  (1 unrouted)
D+  (2 unrouted)
D+_R2-J1C  (1 unrouted)
D-  (1 unrouted)
D-_R1-J1C  (1 unrouted)
DISARM_INPUT  (2 unrouted)
DROGUE-LED  (1 unrouted)
EX_ANT  (1 unrouted)
FET_A  (3 unrouted)
FET_B  (3 unrouted)
FET_C  (3 unrouted)
FET_D  (3 unrouted)
FIRE_A  (3 unrouted)
FIRE_B  (3 unrouted)
FIRE_C  (3 unrouted)
FIRE_D  (3 unrouted)
GND  (133 unrouted)
HOLD  (1 unrouted)
ID  (1 unrouted)
J1-C_R1-J1C  (1 unrouted)
J1-C_R2-J1C  (1 unrouted)
MAIN-LED  (1 unrouted)
MASTER_RX-1  (2 unrouted)
MASTER_RX-2  (2 unrouted)
MASTER_TX-1  (2 unrouted)
MASTER_TX-2  (2 unrouted)
MISO-1  (2 unrouted)
MISO-1V8  (1 unrouted)
MISO-3  (1 unrouted)
MOSI-1  (4 unrouted)
MOSI-1V8  (1 unrouted)
MOSI-3  (1 unrouted)
N$1  (via drill 3 pad 4)
  other vias: 5.08,5.08
N$3  (via drill 3 pad 4)
  other vias: 5.08,96.52
N$4  (via drill 3 pad 4)
  other vias: 147.32,96.52
N$5  (via drill 3 pad 4)
  other vias: 147.32,5.08
NRST  (4 unrouted)
OSC_IN  (2 unrouted)
OSC_OUT  (2 unrouted)
Q1-LS1C_R2-LS1C  (1 unrouted)
R1-LS1C_Q1-LS1C  (1 unrouted)
R2-LS1C_LS1-C  (1 unrouted)
REGOUT  (1 unrouted)
RTS  (2 unrouted)
SCL-1  (2 unrouted)
SDA-1  (2 unrouted)
SENSE_A  (4 unrouted)
SENSE_B  (4 unrouted)
SENSE_C  (4 unrouted)
SENSE_D  (4 unrouted)
SENSOR-ERROR  (2 unrouted)
SENSOR-NOMINAL  (2 unrouted)
STORAGE-ERROR  (1 unrouted)
SWCLK  (3 unrouted)
SWDIO  (3 unrouted)
SWO  (1 unrouted)
U0S-SW  (1 unrouted)
U1P-PROG  (1 unrouted)
U1P-STAT  (1 unrouted)
U1S-CHECK  (2 unrouted)
U2P-FB  (3 unrouted)
U2S-CHECK  (2 unrouted)
U2S-ST  (2 unrouted)
U3S-CHECK  (2 unrouted)
U4S-CHECK  (2 unrouted)
U9P-FB  (4 unrouted)
U9P-LX1_1  (1 unrouted)
U9P-LX2_1  (1 unrouted)
U9P-SW  (1 unrouted)
US2-STATUS  (2 unrouted)
V_LDO_IN  (10 unrouted)
VBAT  (7 unrouted)
VBAT_AFTER_SWITCH  (2 unrouted)
VCAP_1  (1 unrouted)
VCAP_2  (1 unrouted)
VDDA  (2 unrouted)
VOUT  (1 unrouted)
VR1-LS1C  (1 unrouted)
VR1-LS1C_R3-LS1C  (1 unrouted)
VUSB  (4 unrouted)
WP  (1 unrouted)